# EasyEDA Pro project 4轴3.0控制板PCB源文件LY-4X3.0-V3.4.eprj, board 4轴3.0
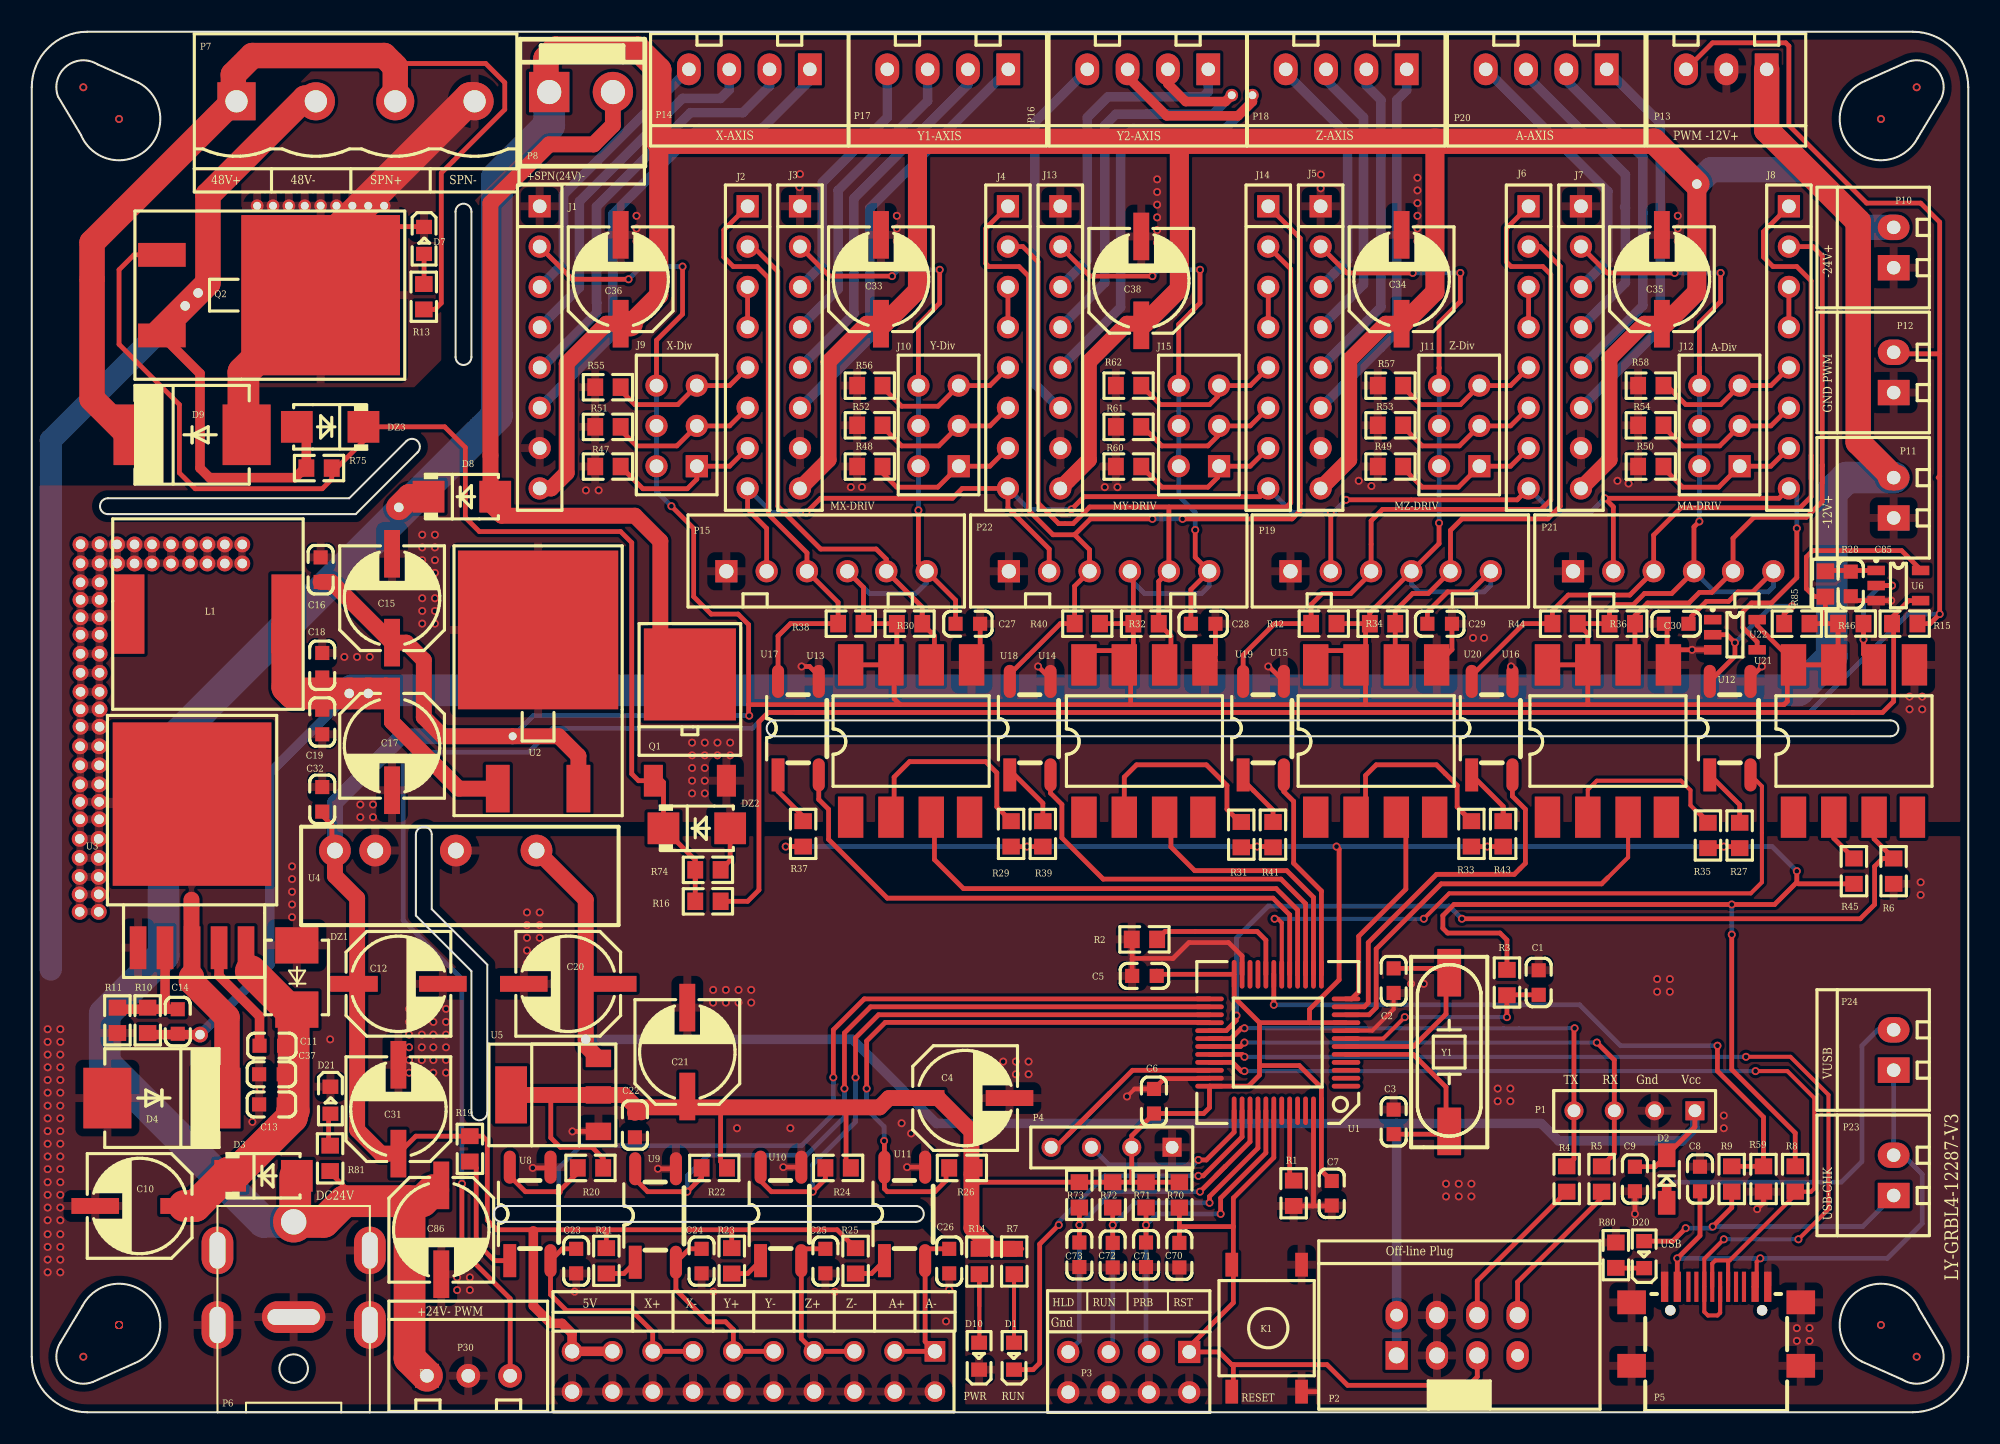
[diagram p1: board, top side]
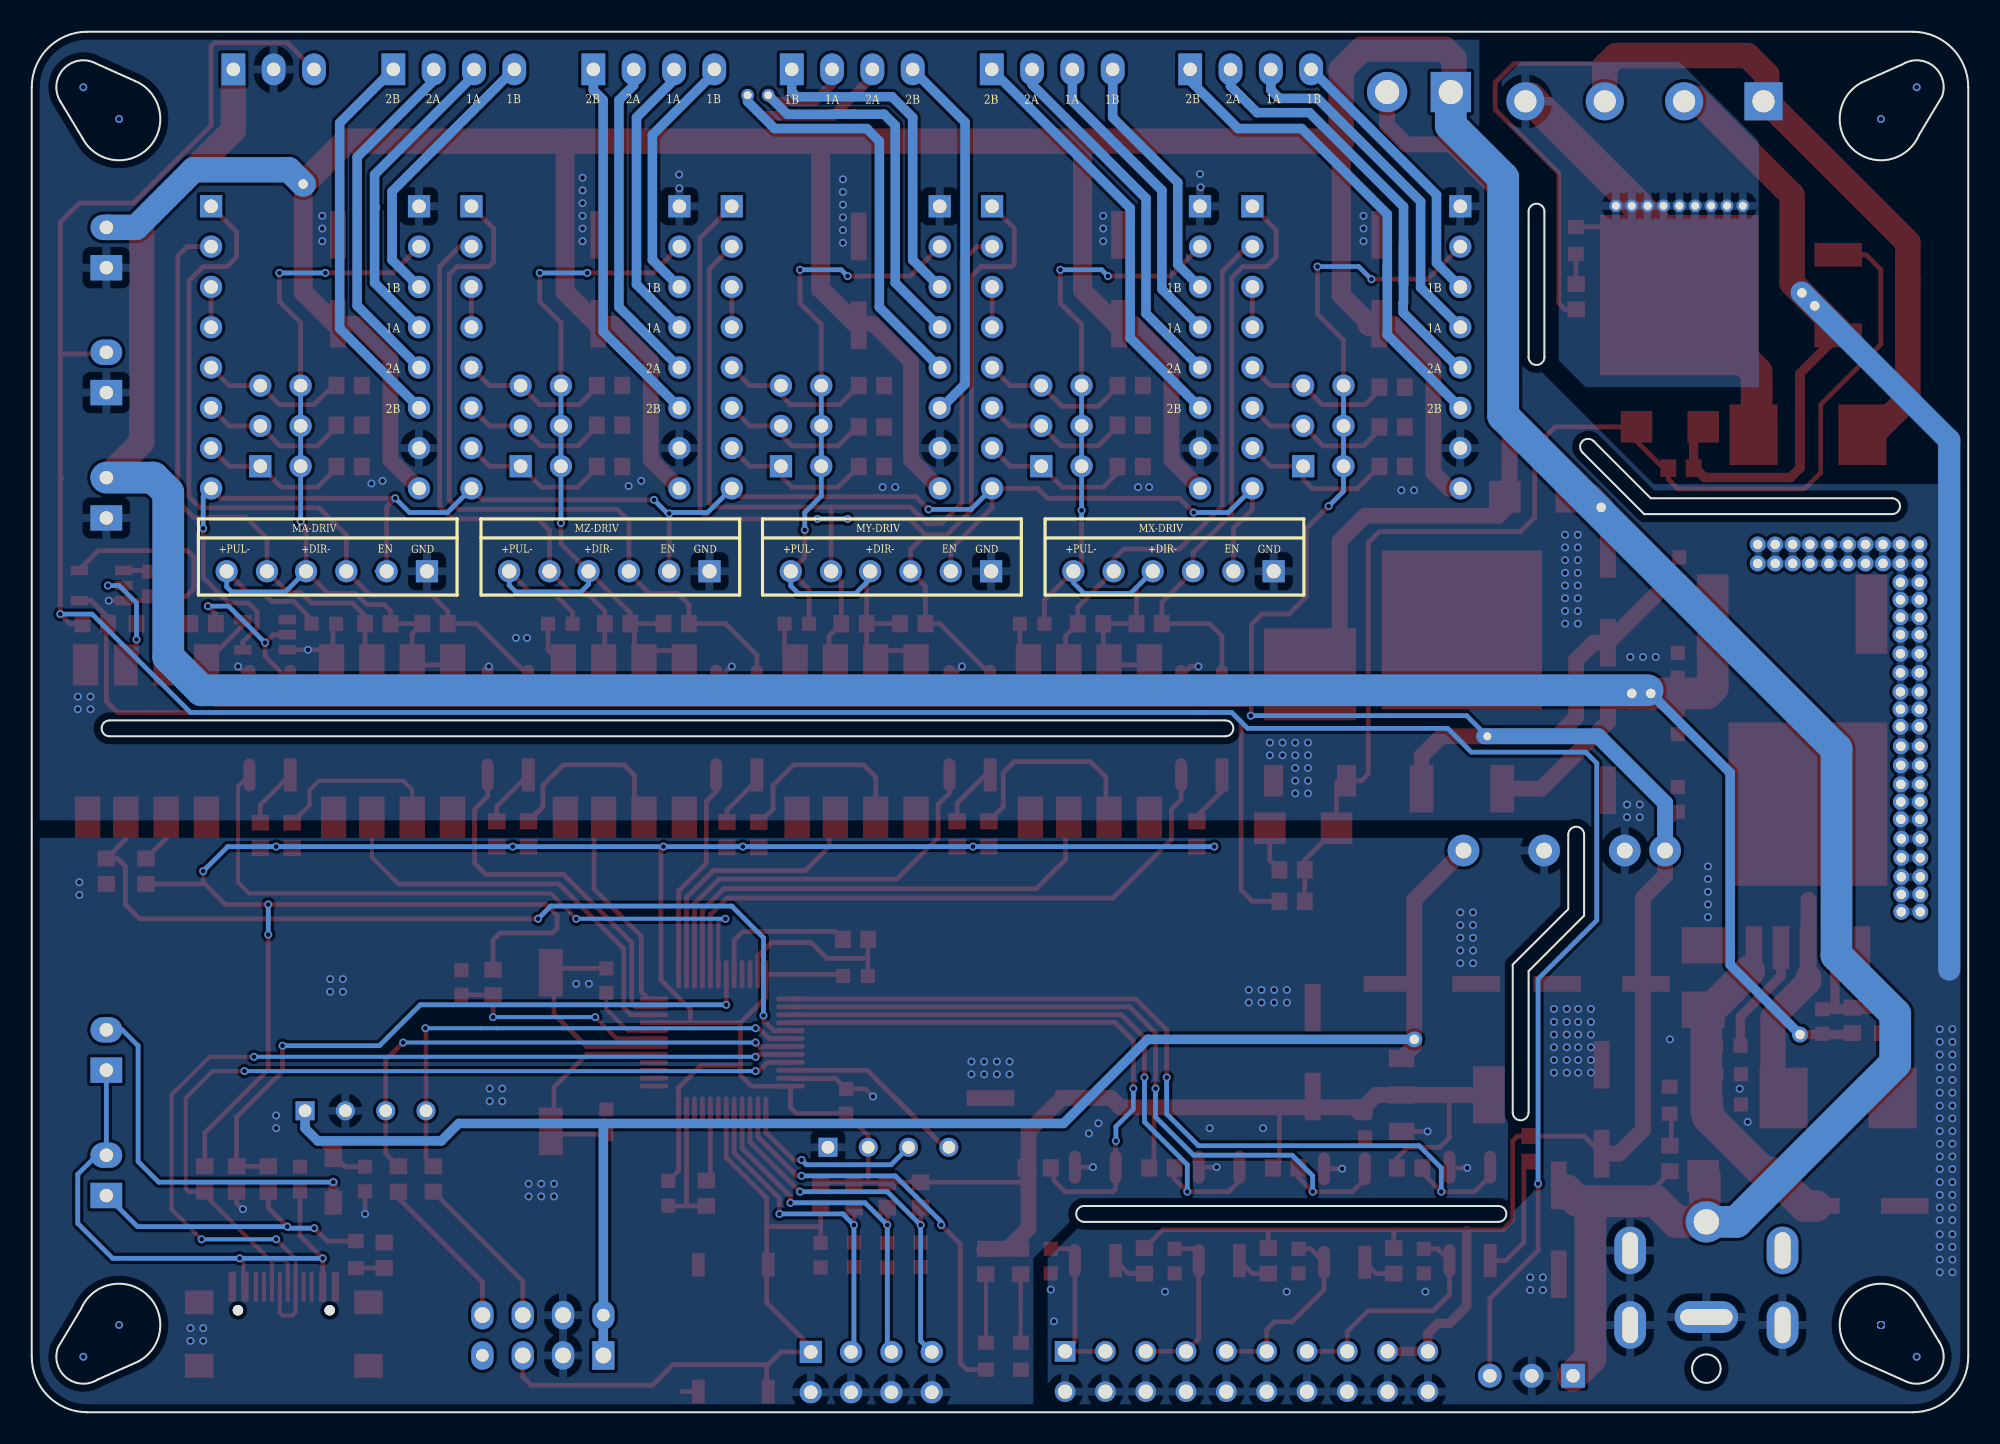
[diagram p2: board, bottom side, seen from below]

Outline 122 x 87 mm; copper layers: Top Layer, Bottom Layer. Coordinates in mm from the lower left corner of the outline.
Outline path: 0,83.5 0,3.5 arc(1.03,1.03) 3.5,0 118.5,0 arc(120.97,1.03) 122,3.5 122,83.5 arc(120.97,85.97) 118.5,87 3.5,87 arc(1.03,85.97) 0,83.5 ; 1.65,82.92 3.1,80.5 arc(7.26,79.58) 6.7,83.81 4.15,84.94 arc(2.18,84.82) 1.65,82.92 ; 3.19,6.7 1.81,4.4 arc(1.93,2.43) 3.83,1.9 6.5,3.1 arc(7.42,7.26) 3.19,6.7 ; 4.8,56.6 arc(4.3,57.1) 4.8,57.6 20,57.6 23.6,61.2 arc(24.31,61.2) 24.31,60.49 20.41,56.6 4.8,56.6 ; 24.2,36.4 24.2,31.3 27.7,27.8 27.7,18.9 arc(28.2,18.4) 28.7,18.9 28.7,28.21 25.2,31.71 25.2,36.4 arc(24.7,36.9) 24.2,36.4 ; 26.7,75.66 26.7,66.5 arc(27.2,66) 27.7,66.5 27.7,75.66 arc(27.2,76.16) 26.7,75.66 ; 29.6,12 arc(29.1,12.5) 29.6,13 55.7,13 arc(56.2,12.5) 55.7,12 29.6,12 ; 46.8,42.6 arc(46.3,43.1) 46.8,43.6 117.1,43.6 arc(117.6,43.1) 117.1,42.6 46.8,42.6 ; 115.3,3.19 117.85,2.06 arc(119.82,2.18) 120.35,4.09 118.9,6.5 arc(114.74,7.42) 115.3,3.19 ; 118.16,85.1 115.5,83.9 arc(114.58,79.74) 118.81,80.3 120.19,82.6 arc(120.07,84.57) 118.16,85.1
Stack: Top Layer 0.0356mm / Dielectric1 0.32mm FR-4 er 4.8 / Bottom Layer 0.0356mm

## Design rules (mm)
net C86: Top Side Components
net P30: Top Side Components
net R85: Top Side Components
net C85: Top Side Components
net R75: Top Side Components
net R74: Top Side Components
net DZ3: Top Side Components
net DZ2: Top Side Components
net U22: Top Side Components
net C37: Top Side Components
net C1: Top Side Components
net C2: Top Side Components
net C3: Top Side Components
net C4: Top Side Components
net C5: Top Side Components
net C6: Top Side Components
net C7: Top Side Components
net C8: Top Side Components
net C9: Top Side Components
net C10: Top Side Components
net C11: Top Side Components
net C12: Top Side Components
net C13: Top Side Components
net C14: Top Side Components
net C15: Top Side Components
net C16: Top Side Components
net C17: Top Side Components
net C18: Top Side Components
net C19: Top Side Components
net C20: Top Side Components
net C21: Top Side Components
net C22: Top Side Components
net C23: Top Side Components
net C24: Top Side Components
net C25: Top Side Components
net C26: Top Side Components
net C27: Top Side Components
net C28: Top Side Components
net C29: Top Side Components
net C30: Top Side Components
net C31: Top Side Components
net C32: Top Side Components
net C33: Top Side Components
net C34: Top Side Components
net C35: Top Side Components
net C36: Top Side Components
net D1: Top Side Components
net D2: Top Side Components
net D3: Top Side Components
net D4: Top Side Components
net D7: Top Side Components
net D8: Top Side Components
net D9: Top Side Components
net D10: Top Side Components
net DZ1: Top Side Components
net J1: Top Side Components
net J2: Top Side Components
net J3: Top Side Components
net J4: Top Side Components
net J5: Top Side Components
net J6: Top Side Components
net J7: Top Side Components
net J8: Top Side Components
net J9: Top Side Components
net J10: Top Side Components
net J11: Top Side Components
net J12: Top Side Components
net K1: Top Side Components
net L1: Top Side Components
net P1: Top Side Components
net P2: Top Side Components
net P3: Top Side Components
net P4: Top Side Components
net P6: Top Side Components
net P7: Top Side Components
net P8: Top Side Components
net P9: Top Side Components
net P10: Top Side Components
net P11: Top Side Components
net P12: Top Side Components
net P13: Top Side Components
net P14: Top Side Components
net P15: Top Side Components
net P17: Top Side Components
net P18: Top Side Components
net P19: Top Side Components
net P20: Top Side Components
net P21: Top Side Components
net P22: Top Side Components
net Q1: Top Side Components
net Q2: Top Side Components
net R1: Top Side Components
net R2: Top Side Components
net R3: Top Side Components
net R4: Top Side Components
net R5: Top Side Components
net R6: Top Side Components
net R7: Top Side Components
net R8: Top Side Components
net R10: Top Side Components
net R11: Top Side Components
net R13: Top Side Components
net R14: Top Side Components
net R15: Top Side Components
net R16: Top Side Components
net R19: Top Side Components
net R20: Top Side Components
net R21: Top Side Components
net R22: Top Side Components
net R23: Top Side Components
net R24: Top Side Components
net R25: Top Side Components
net R26: Top Side Components
net R27: Top Side Components
net R28: Top Side Components
net R29: Top Side Components
net R30: Top Side Components
net R31: Top Side Components
net R32: Top Side Components
net R33: Top Side Components
net R34: Top Side Components
net R35: Top Side Components
net R36: Top Side Components
net R37: Top Side Components
net R38: Top Side Components
net R39: Top Side Components
net R40: Top Side Components
net R41: Top Side Components
net R42: Top Side Components
net R43: Top Side Components
net R44: Top Side Components
net R45: Top Side Components
net R46: Top Side Components
net R47: Top Side Components
net R48: Top Side Components
net R49: Top Side Components
net R50: Top Side Components
net R51: Top Side Components
net R52: Top Side Components
net R53: Top Side Components
net R54: Top Side Components
net R55: Top Side Components
net R56: Top Side Components
net R57: Top Side Components
net R58: Top Side Components
net U1: Top Side Components
net U2: Top Side Components
net U3: Top Side Components
net U4: Top Side Components
net U5: Top Side Components
net U6: Top Side Components
net U8: Top Side Components
net U9: Top Side Components
net U10: Top Side Components
net U11: Top Side Components
net U12: Top Side Components
net U13: Top Side Components
net U14: Top Side Components
net U15: Top Side Components
net U16: Top Side Components
net U17: Top Side Components
net U18: Top Side Components
net U19: Top Side Components
net U20: Top Side Components
net U21: Top Side Components
net Y1: Top Side Components
net R9: Top Side Components
net R59: Top Side Components
net P5: Top Side Components
net D20: Top Side Components
net R80: Top Side Components
net D21: Top Side Components
net R81: Top Side Components
net C38: Top Side Components
net J13: Top Side Components
net J14: Top Side Components
net J15: Top Side Components
net P16: Top Side Components
net R60: Top Side Components
net R61: Top Side Components
net R62: Top Side Components
net P23: Top Side Components
net P24: Top Side Components
net C70: Top Side Components
net C71: Top Side Components
net C72: Top Side Components
net C73: Top Side Components
net R70: Top Side Components
net R71: Top Side Components
net R72: Top Side Components
net R73: Top Side Components
net D6: 电源
net R12: 电源
spacing Clearance (default): track to track 0.178, other pairs 0.178 to 0.178
track width Width (default): min 0.1, default 0.254, max 5
differential pair DiffPairsRouting (default): width min 0.381, default 0.381, max 0.381; gap min 0.254, default 0.254
via RoutingVias (default): diameter min 0.3, default 0.8, max 1.27; hole min 0.3, default 0.6, max 2

## Placement (name value [footprint] x y rotation side)
C1  104  [0603C]  94.94 27.08 270 top
C2  100pF  [0603C]  85.8 27.2 270 top
C3  100pF  [0603C]  85.8 18.3 90 top
C4  220uF/16V  [电解电容贴片6x6]  58.8 19.8 0 top
C5  104  [0603C]  70.1 27.5 0 top
C6  104  [0603C]  70.7 19.6 270 top
C7  104  [0603C]  81.9 13.8 90 top
C8  104  [0603C]  105.1 14.7 270 top
C9  104  [0603C]  101 14.7 90 top
C10  47uF/50V  [电解电容贴片6x6]  6.8 13 180 top
C11  105  [0603C]  15.13 23.1 0 top
C12  100uF/35V  [电解电容贴片6x6]  23.1 27 0 top
C13  105  [0603C]  15.1 19.4 0 top
C14  33nF  [0603C]  9.2 24.63 270 top
C15  100uF/35V  [电解电容贴片6x6]  22.7 51.3 90 top
C16  105  [0603C]  18.2 53.1 270 top
C17  100uF/35V  [电解电容贴片6x6]  22.7 42 270 top
C18  105  [0603C]  18.3 47.07 270 top
C19  104  [0603C]  18.3 43.5 90 top
C20  100uF/35V  [电解电容贴片6x6]  33.8 27 180 top
C21  100uF/35V  [电解电容贴片6x6]  41.3 22.7 90 top
C22  104  [0603C]  38 18.1 90 top
C23  104  [0603C]  34.3 9.53 90 top
C24  104  [0603C]  42.2 9.53 90 top
C25  104  [0603C]  50 9.53 90 top
C26  104  [0603C]  57.8 9.53 90 top
C27  104  [0603C]  58.97 49.69 180 top
C28  104  [0603C]  73.8 49.69 180 top
C29  104  [0603C]  88.7 49.69 180 top
C30  104  [0603C]  103.6 49.69 0 top
C31  220uF/16V  [电解电容贴片6x6]  23.1 19.1 90 top
C32  104  [0603C]  18.3 38.63 270 top
C33  47uF/50V  [电解电容贴片6x6]  53.5 71.4 90 top
C34  47uF/50V  [电解电容贴片6x6]  86.3 71.4 90 top
C35  47uF/50V  [电解电容贴片6x6]  102.7 71.4 90 top
C36  47uF/50V  [电解电容贴片6x6]  37.1 71.4 90 top
C37  104  [0603C]  15.1 21.3 0 top
C38  47uF/50V  [电解电容贴片6x6]  69.9 71.3 90 top
C70  18pF  [0603C]  72.3 9.9 90 top
C71  18pF  [0603C]  70.2 9.93 90 top
C72  18pF  [0603C]  68.1 9.9 90 top
C73  18pF  [0603C]  66 9.93 90 top
C85  18pF  [0603C]  114.6 52.2 90 top
C86  47uF/50V  [电解电容贴片6x6]  25.8 11.5 270 top
D1  绿光  [0603LED]  61.9 3.5 270 top
D2  S4  [SOD-123]  103 14.7 90 top
D3  SS56  [SMA]  14.6 14.9 0 top
D4  SS56  [SMC]  8.2 19.8 180 top
D7  绿光  [0603LED]  24.7 73.88 90 top
D8  SS56  [SMA]  27.1 57.7 0 top
D9  RS5M  [SMC]  10.1 61.6 0 top
D10  红光  [0603LED]  59.7 3.5 270 top
D20  红光  [0603LED]  101.6 9.9 270 top
D21  红光  [0603LED]  18.8 19.7 90 top
DZ1  SMBJ36A  [SMB]  16.7 27.4 90 top
DZ2  SMAZ10V  [SMA]  41.9 36.8 0 top
DZ3  SMAZ10V  [SMA]  18.8 62.1 180 top
J1  8P  [HDR1X8]  32 65.84 270 top
J2  8P  [HDR1X8]  45.1 65.84 270 top
J3  8P  [HDR1X8]  48.4 65.84 270 top
J4  8P  [HDR1X8]  61.5 65.84 270 top
J5  8P  [HDR1X8]  81.2 65.84 270 top
J6  8P  [HDR1X8]  94.3 65.84 270 top
J7  8P  [HDR1X8]  97.6 65.84 270 top
J8  8P  [HDR1X8]  110.7 65.84 270 top
J9  DIV-X  [HDR2X3]  41.9 59.62 90 top
J10  DIV-Y  [HDR2X3]  58.4 59.62 90 top
J11  DIV-Z  [HDR2X3]  91.2 59.62 90 top
J12  DIV-A  [HDR2X3]  107.6 59.62 90 top
J13  8P  [HDR1X8]  64.8 65.84 270 top
J14  8P  [HDR1X8]  77.9 65.84 270 top
J15  DIV-Y2  [HDR2X3]  74.8 59.62 90 top
K1  开关  [按键6x6贴片]  77.8 5.3 0 top
L1  47uH/5A  [电感贴片12x12]  11.1 50.3 0 top
NOREF  -  [Pad_ie79]  3.07 45.4 0 top
NOREF#2  -  [Pad_ie95]  20.2 76.03 180 top
NOREF#3  -  [Pad_ie36]  5.37 53.49 270 top
NOREF#4  -  [Pad_ie45]  3.02 33.74 0 top
NOREF#5  -  [Pad_ie89]  30.3 42.6 180 top
NOREF#6  -  [Pad_ie51]  4.22 36.14 0 top
NOREF#7  -  [Pad_ie41]  104.9 77.4 90 top
NOREF#8  -  [Pad_ie59]  4.25 38.47 0 top
NOREF#9  -  [Pad_ie99]  76.9 83 0 top
NOREF#10  -  [Pad_ie38]  7.57 53.49 270 top
NOREF#11  -  [Pad_ie57]  4.25 40.77 0 top
NOREF#12  -  [Pad_ie55]  3.05 39.57 0 top
NOREF#13  -  [Pad_ie71]  4.27 50.1 0 top
NOREF#14  -  [Pad_ie25]  13.26 54.69 270 top
NOREF#15  -  [Pad_ie68]  4.27 53.5 0 top
NOREF#16  -  [Pad_ie29]  12.16 53.49 270 top
NOREF#17  -  [Pad_ie39]  8.77 53.49 270 top
NOREF#18  -  [Pad_ie35]  5.37 54.69 270 top
NOREF#19  -  [Pad_ie64]  9.67 69.72 180 top
NOREF#20  -  [Pad_ie28]  11.06 53.49 270 top
NOREF#21  -  [Pad_ie98]  75.6 83 0 top
NOREF#22  -  [Pad_ie58]  4.25 39.57 0 top
NOREF#23  -  [Pad_ie37]  6.47 53.49 270 top
NOREF#24  -  [Pad_ie83]  3.07 49 0 top
NOREF#25  -  [Pad_ie75]  4.27 44.3 0 top
NOREF#26  -  [Pad_ie80]  3.07 44.3 0 top
NOREF#27  -  [Pad_ie91]  16.2 76.03 180 top
NOREF#28  -  [Pad_ie30]  13.26 53.49 270 top
NOREF#29  -  [Pad_ie69]  4.27 52.3 0 top
NOREF#30  -  [Pad_ie65]  34.9 23.5 0 top
NOREF#31  -  [Pad_ie34]  6.47 54.69 270 top
NOREF#32  -  [Pad_ie44]  3.02 32.64 0 top
NOREF#33  -  [Pad_ie97]  22.2 76.03 180 top
NOREF#34  -  [Pad_ie63]  10.48 70.54 180 top
NOREF#35  -  [Pad_ie54]  3.05 38.47 0 top
NOREF#36  -  [Pad_ie90]  15.2 76.03 180 top
NOREF#37  -  [Pad_ie31]  9.97 54.69 270 top
NOREF#38  -  [Pad_ie87]  3.07 53.5 0 top
NOREF#39  -  [Pad_ie85]  3.07 51.2 0 top
NOREF#40  -  [Pad_ie77]  4.27 46.6 0 top
NOREF#41  -  [Pad_ie67]  4.27 54.7 0 top
NOREF#42  -  [Pad_ie102]  23.12 57.02 0 top
NOREF#43  -  [Pad_ie76]  4.27 45.4 0 top
NOREF#44  -  [Pad_ie73]  4.27 47.8 0 top
NOREF#45  -  [Pad_ie50]  4.22 31.54 0 top
NOREF#46  -  [Pad_ie40]  9.97 53.49 270 top
NOREF#47  -  [Pad_ie88]  3.07 54.7 0 top
NOREF#48  -  [Pad_ie47]  4.22 34.94 0 top
NOREF#49  -  [Pad_ie101]  21.2 45.3 0 top
NOREF#50  -  [Pad_ie93]  18.2 76.03 180 top
NOREF#51  -  [Pad_ie66]  20 45.3 0 top
NOREF#52  -  [Pad_ie46]  3.02 34.94 0 top
NOREF#53  -  [Pad_ie82]  3.07 47.8 0 top
NOREF#54  -  [Pad_ie27]  11.06 54.69 270 top
NOREF#55  -  [Pad_ie96]  21.2 76.03 180 top
NOREF#56  -  [Pad_ie94]  19.2 76.03 180 top
NOREF#57  -  [Pad_ie62]  10.6 23.8 90 top
NOREF#58  -  [Pad_ie92]  17.2 76.03 180 top
NOREF#59  -  [Pad_ie43]  3.02 31.54 0 top
NOREF#60  -  [Pad_ie49]  4.22 32.64 0 top
NOREF#61  -  [Pad_ie56]  3.05 40.77 0 top
NOREF#62  -  [Pad_ie60]  4.25 37.37 0 top
NOREF#63  -  [Pad_ie78]  3.07 46.6 0 top
NOREF#64  -  [Pad_ie26]  12.16 54.69 270 top
NOREF#65  -  [Pad_ie52]  3.05 41.97 0 top
NOREF#66  -  [Pad_ie100]  14.2 76.03 180 top
NOREF#67  -  [Pad_ie81]  3.07 43.2 0 top
NOREF#68  -  [Pad_ie42]  3.02 36.14 0 top
NOREF#69  -  [Pad_ie84]  3.07 50.1 0 top
NOREF#70  -  [Pad_ie48]  4.22 33.74 0 top
NOREF#71  -  [Pad_ie70]  4.27 51.2 0 top
NOREF#72  -  [Pad_ie32]  8.77 54.69 270 top
NOREF#73  -  [Pad_ie61]  4.25 41.97 0 top
NOREF#74  -  [Pad_ie72]  4.27 49 0 top
NOREF#75  -  [Pad_ie53]  3.05 37.37 0 top
NOREF#76  -  [Pad_ie74]  4.27 43.2 0 top
NOREF#77  -  [Pad_ie33]  7.57 54.69 270 top
NOREF#78  -  [Pad_ie86]  3.07 52.3 0 top
P1  4P  [SIP4]  104.78 19 180 top
P2  8P  [IDC8]  89.8 4.6 0 top
P3  Header 4X2H  [HDR2X4H]  72.92 3.8 180 top
P4  4P  [SIP4]  71.84 16.7 180 top
P5  USB座TYPE-C-16P  [USB-TYPE-C-16P-全贴片]  106.12 5.22 0 top
P6  -  [DC007B]  16.5 0 270 top
P7  DF2EDGK-4P  [直插座4P-DF2EDGK]  20.4 82.62 0 top
P8  2P  [VH3.96-2P直插座]  34.75 84.04 180 top
P9  Header 10X2H  [HDR2X10]  56.9 3.84 180 top
P10  2P红色  [HDR1X2_CON]  117.3 73.4 90 top
P11  2P红色  [HDR1X2_CON]  117.3 57.63 90 top
P12  2P  [HDR1X2_CON]  117.3 65.53 90 top
P13  3P  [HDR1X3_CON#2]  106.76 84.63 180 top
P14  4P  [HDR1X4_CON]  49.02 84.63 180 top
P15  6P  [HDR1X6_CON]  43.76 53 0 top
P16  4P  [HDR1X4_CON]  74.12 84.63 180 top
P17  4P  [HDR1X4_CON]  61.52 84.63 180 top
P18  4P  [HDR1X4_CON]  86.62 84.63 180 top
P19  6P  [HDR1X6_CON]  79.3 53 0 top
P20  4P  [HDR1X4_CON]  99.22 84.63 180 top
P21  6P  [HDR1X6_CON]  97.1 53 0 top
P22  6P  [HDR1X6_CON]  61.56 53 0 top
P23  2P  [HDR1X2_CON]  117.3 14.93 90 top
P24  2P  [HDR1X2_CON]  117.3 22.83 90 top
P30  3P  [HDR1X3_CON]  27.5 2.3 0 top
Q1  50N06  [TO-252]  41.46 42.4 0 top
Q2  F540NS  [TO-263-2]  8.2 70.4 180 top
R1  10K  [0603R]  79.5 13.8 90 top
R2  10K  [0603R]  70.1 29.8 0 top
R3  10K  [0603R]  92.94 27.08 270 top
R4  100  [0603R]  96.7 14.7 270 top
R5  100  [0603R]  98.9 14.7 270 top
R6  2K  [0603R]  117.3 34.1 90 top
R7  1K  [0603R]  61.9 9.5 90 top
R8  10K  [0603R]  111.1 14.7 270 top
R9  1K  [0603R]  107.1 14.7 90 top
R10  16K  [0603R]  7.3 24.7 270 top
R11  1.8K  [0603R]  5.4 24.7 90 top
R13  10K  [0603R]  24.7 70.3 90 top
R14  1K  [0603R]  59.7 9.5 270 top
R15  100  [0603R]  118 49.7 180 top
R16  680  [0603R]  42.6 32.2 180 top
R19  680  [0603R]  27.6 16.6 270 top
R20  10K  [0603R]  35.2 15.4 180 top
R21  680  [0603R]  36.2 9.54 270 top
R22  10K  [0603R]  43 15.4 180 top
R23  680  [0603R]  44.1 9.54 270 top
R24  10K  [0603R]  50.8 15.4 180 top
R25  680  [0603R]  51.9 9.54 270 top
R26  10K  [0603R]  58.6 15.4 180 top
R27  470  [0603R]  107.6 36.35 90 top
R28  10K  [0603R]  111.2 49.7 180 top
R29  470  [0603R]  61.7 36.45 90 top
R30  470  [0603R]  55.3 49.69 0 top
R31  470  [0603R]  76.2 36.4 90 top
R32  470  [0603R]  70.2 49.69 0 top
R33  470  [0603R]  90.7 36.45 90 top
R34  470  [0603R]  85.1 49.69 0 top
R35  470  [0603R]  105.6 36.35 90 top
R36  470  [0603R]  100.2 49.69 0 top
R37  470  [0603R]  48.6 36.45 90 top
R38  10K  [0603R]  51.6 49.7 180 top
R39  470  [0603R]  63.7 36.45 90 top
R40  10K  [0603R]  66.5 49.7 180 top
R41  470  [0603R]  78.2 36.4 90 top
R42  10K  [0603R]  81.4 49.7 180 top
R43  470  [0603R]  92.7 36.45 90 top
R44  10K  [0603R]  96.6 49.7 180 top
R45  470  [0603R]  114.8 34.1 90 top
R46  470  [0603R]  114.6 49.7 0 top
R47  10K  [0603R]  36.3 59.6 180 top
R48  10K  [0603R]  52.8 59.6 180 top
R49  10K  [0603R]  85.6 59.6 180 top
R50  10K  [0603R]  102 59.6 180 top
R51  10K  [0603R]  36.3 62.1 180 top
R52  10K  [0603R]  52.8 62.2 180 top
R53  10K  [0603R]  85.6 62.2 180 top
R54  10K  [0603R]  102 62.2 180 top
R55  10K  [0603R]  36.3 64.6 180 top
R56  10K  [0603R]  52.8 64.7 180 top
R57  10K  [0603R]  85.6 64.7 180 top
R58  10K  [0603R]  102 64.7 180 top
R59  1.8K  [0603R]  109.1 14.7 270 top
R60  10K  [0603R]  69.1 59.6 180 top
R61  10K  [0603R]  69.1 62.1 180 top
R62  10K  [0603R]  69.1 64.7 180 top
R70  10K  [0603R]  72.3 13.7 90 top
R71  10K  [0603R]  70.2 13.7 90 top
R72  10K  [0603R]  68.1 13.7 90 top
R73  10K  [0603R]  66 13.7 90 top
R74  10K  [0603R]  42.6 34.18 0 top
R75  10K  [0603R]  18.1 59.5 0 top
R80  1K  [0603R]  99.8 9.9 90 top
R81  10K  [0603R]  18.8 16 90 top
R85  10K  [0603R]  113 52.2 90 top
U1  STM32F103C8T6/CBT6  [LQFP48]  78.5 23.3 180 top
U2  CJ7805  [TO-263-2]  31.9 39.3 270 top
U3  XL4015  [TO-263]  10.1 33.8 0 top
U4  B0505LS-1WR2  [B0505LS-1W]  25.45 35.4 0 top
U5  1117-3.3  [SOT-223]  33 20 90 top
U6  74LVC1G126/74LVC1G08  [SOT-23-5]  117.6 52.1 0 top
U8  LTV-357T-B  [SOP4]  31.4 12.5 90 top
U9  LTV-357T-B  [SOP4]  39.3 12.4 90 top
U10  LTV-357T-B  [SOP4]  47.2 12.5 90 top
U11  LTV-357T-B  [SOP4]  55 12.5 90 top
U12  LTV-357T-B  [SOP4]  107 43.11 90 top
U13  6N137  [SMD8]  55.4 42.3 0 top
U14  6N137  [SMD8]  70.1 42.3 0 top
U15  6N137  [SMD8]  84.7 42.3 0 top
U16  6N137  [SMD8]  99.3 42.3 0 top
U17  LTV-357T-B  [SOP4]  48.3 43.11 90 top
U18  LTV-357T-B  [SOP4]  62.9 43.11 90 top
U19  LTV-357T-B  [SOP4]  77.6 43.11 90 top
U20  LTV-357T-B  [SOP4]  92 43.11 90 top
U21  6N137  [SMD8#2]  114.8 42.3 0 top
U22  74LVC1G17  [SOT-23-5]  107.3 49 0 top
Y1  8M  [晶振贴片]  89.3 22.7 90 top

## Footprints (pads in the part's own frame, mm; a bottom-side part is the same pattern mirrored in y, then rotated)
0603C
  rect 0.889x0.889 smd: 1(-0.774,0) 2(0.774,0)
0603LED
  rect 0.9x1 smd: 1(-0.884,-0.017) 2(0.816,-0.017)
0603R
  rect 1x1.1 smd: 1(-0.8,0) 2(0.8,0)
B0505LS-1W
  round 2 hole 1: 1(-6.35,0) 2(-3.81,0) 4(1.27,0) 6(6.35,0)
DC007B
  round 2.6 hole 1.6: 1(-12,0)
  oval 2x4 hole 1x3.3: 2(-6,0)
  oval 3x2 hole 2.3x1: 3(-5.5,4.8) 4(-10.2,4.8) 5(-5.5,-4.8) 6(-10.2,-4.8)
HDR1X2_CON
  rect 1.6x2 hole 0.85: 1(-1.27,0)
  oval 1.6x2 hole 0.85: 2(1.27,0)
HDR1X3_CON
  rect 1.5x1.5 hole 0.86: 1(-2.6,0)
  round 1.5 hole 0.86: 2(0,0) 3(2.64,0)
HDR1X3_CON#2
  rect 1.5x2 hole 0.85: 1(-2.54,0)
  oval 1.5x2 hole 0.85: 2(0,0) 3(2.54,0)
HDR1X4_CON
  rect 1.5x2 hole 0.85: 1(0,0)
  oval 1.5x2 hole 0.85: 2(2.54,0) 3(5.08,0) 4(7.62,0)
HDR1X6_CON
  rect 1.4x1.4 hole 0.9: 1(0,0)
  round 1.4 hole 0.9: 2(2.54,0) 3(5.08,0) 4(7.62,0) 5(10.08,0) 6(12.62,0)
HDR1X8
  rect 1.4x1.4 hole 0.86: 1(-10.16,0)
  round 1.4 hole 0.86: 2(-7.62,0) 3(-5.08,0) 4(-2.54,0) 5(0,0) 6(2.54,0) 7(5.08,0) 8(7.62,0)
HDR2X3
  rect 1.4x1.4 hole 0.86: 1(0,0)
  round 1.4 hole 0.86: 2(2.54,0) 3(5.08,0) 4(5.08,2.54) 5(2.54,2.54) 6(0,2.54)
HDR2X4H
  rect 1.4x1.4 hole 0.86: 1(0,0)
  round 1.4 hole 0.86: 2(0,2.54) 3(2.54,0) 4(2.54,2.54) 5(5.08,0) 6(5.08,2.54) 7(7.62,0) 8(7.62,2.54)
HDR2X10
  rect 1.3x1.3 hole 0.9: 1(0,0)
  round 1.3 hole 0.9: 2(0,2.54) 3(2.54,0) 4(2.54,2.54) 5(5.08,0) 6(5.08,2.54) 7(7.62,0) 8(7.62,2.54) 9(10.16,0) 10(10.16,2.54) 11(12.7,0) 12(12.7,2.54) 13(15.24,0) 14(15.24,2.54) 15(17.78,0) 16(17.78,2.54) 17(20.32,0) 18(20.32,2.54) 19(22.86,0) 20(22.86,2.54)
IDC8
  rect 1.4x1.8 hole 1: 1(-3.812,-1.019)
  oval 1.4x1.8 hole 0.8: 2(-3.812,1.521) 7(3.808,-1.019)
  oval 1.4x1.8 hole 1: 3(-1.272,-1.019) 4(-1.272,1.521) 5(1.268,-1.019) 6(1.268,1.521) 8(3.808,1.521)
LQFP48
  oval 1.8x0.3 smd: 1(-4.3,2.75) 2(-4.3,2.25) 3(-4.3,1.75) 4(-4.3,1.25) 5(-4.3,0.75) 6(-4.3,0.25) 7(-4.3,-0.25) 8(-4.3,-0.75) 9(-4.3,-1.25) 10(-4.3,-1.75) 11(-4.3,-2.25) 12(-4.3,-2.75) 25(4.3,-2.75) 26(4.3,-2.25) 27(4.3,-1.75) 28(4.3,-1.25) 29(4.3,-0.75) 30(4.3,-0.25) 31(4.3,0.25) 32(4.3,0.75) 33(4.3,1.25) 34(4.3,1.75) 35(4.3,2.25) 36(4.3,2.75)
  oval 0.3x1.8 smd: 13(-2.75,-4.3) 14(-2.25,-4.3) 15(-1.75,-4.3) 16(-1.25,-4.3) 17(-0.75,-4.3) 18(-0.25,-4.3) 19(0.25,-4.3) 20(0.75,-4.3) 21(1.25,-4.3) 22(1.75,-4.3) 23(2.25,-4.3) 24(2.75,-4.3) 37(2.75,4.3) 38(2.25,4.3) 39(1.75,4.3) 40(1.25,4.3) 41(0.75,4.3) 42(0.25,4.3) 43(-0.25,4.3) 44(-0.75,4.3) 45(-1.25,4.3) 46(-1.75,4.3) 47(-2.25,4.3) 48(-2.75,4.3)
Pad_ie25
  round 1 hole 0.6: 2(0,0)
Pad_ie26
  round 1 hole 0.6: 3(0,0)
Pad_ie27
  round 1 hole 0.6: 4(0,0)
Pad_ie28
  round 1 hole 0.6: 4(0,0)
Pad_ie29
  round 1 hole 0.6: 3(0,0)
Pad_ie30
  round 1 hole 0.6: 2(0,0)
Pad_ie31
  round 1 hole 0.6: 0(0,0)
Pad_ie32
  round 1 hole 0.6: 1(0,0)
Pad_ie33
  round 1 hole 0.6: 2(0,0)
Pad_ie34
  round 1 hole 0.6: 3(0,0)
Pad_ie35
  round 1 hole 0.6: 4(0,0)
Pad_ie36
  round 1 hole 0.6: 4(0,0)
Pad_ie37
  round 1 hole 0.6: 3(0,0)
Pad_ie38
  round 1 hole 0.6: 2(0,0)
Pad_ie39
  round 1 hole 0.6: 1(0,0)
Pad_ie40
  round 1 hole 0.6: 0(0,0)
Pad_ie41
  round 1 hole 0.6: 1(0,0)
Pad_ie42
  round 1 hole 0.6: 6(0,0)
Pad_ie43
  round 1 hole 0.6: 4(0,0)
Pad_ie44
  round 1 hole 0.6: 3(0,0)
Pad_ie45
  round 1 hole 0.6: 2(0,0)
Pad_ie46
  round 1 hole 0.6: 1(0,0)
Pad_ie47
  round 1 hole 0.6: 1(0,0)
Pad_ie48
  round 1 hole 0.6: 2(0,0)
Pad_ie49
  round 1 hole 0.6: 3(0,0)
Pad_ie50
  round 1 hole 0.6: 4(0,0)
Pad_ie51
  round 1 hole 0.6: 6(0,0)
Pad_ie52
  round 1 hole 0.6: 6(0,0)
Pad_ie53
  round 1 hole 0.6: 4(0,0)
Pad_ie54
  round 1 hole 0.6: 3(0,0)
Pad_ie55
  round 1 hole 0.6: 2(0,0)
Pad_ie56
  round 1 hole 0.6: 1(0,0)
Pad_ie57
  round 1 hole 0.6: 1(0,0)
Pad_ie58
  round 1 hole 0.6: 2(0,0)
Pad_ie59
  round 1 hole 0.6: 3(0,0)
Pad_ie60
  round 1 hole 0.6: 4(0,0)
Pad_ie61
  round 1 hole 0.6: 6(0,0)
Pad_ie62
  round 1 hole 0.6: 0(0,0)
Pad_ie63
  round 1 hole 0.6: 1(0,0)
Pad_ie64
  round 1 hole 0.6: 0(0,0)
Pad_ie65
  round 1 hole 0.6: 12(0,0)
Pad_ie66
  round 1 hole 0.6: 8(0,0)
Pad_ie67
  round 1 hole 0.6: 0(0,0)
Pad_ie68
  round 1 hole 0.6: 1(0,0)
Pad_ie69
  round 1 hole 0.6: 2(0,0)
Pad_ie70
  round 1 hole 0.6: 3(0,0)
Pad_ie71
  round 1 hole 0.6: 4(0,0)
Pad_ie72
  round 1 hole 0.6: 5(0,0)
Pad_ie73
  round 1 hole 0.6: 6(0,0)
Pad_ie74
  round 1 hole 0.6: 4(0,0)
Pad_ie75
  round 1 hole 0.6: 3(0,0)
Pad_ie76
  round 1 hole 0.6: 2(0,0)
Pad_ie77
  round 1 hole 0.6: 1(0,0)
Pad_ie78
  round 1 hole 0.6: 1(0,0)
Pad_ie79
  round 1 hole 0.6: 2(0,0)
Pad_ie80
  round 1 hole 0.6: 3(0,0)
Pad_ie81
  round 1 hole 0.6: 4(0,0)
Pad_ie82
  round 1 hole 0.6: 6(0,0)
Pad_ie83
  round 1 hole 0.6: 5(0,0)
Pad_ie84
  round 1 hole 0.6: 4(0,0)
Pad_ie85
  round 1 hole 0.6: 3(0,0)
Pad_ie86
  round 1 hole 0.6: 2(0,0)
Pad_ie87
  round 1 hole 0.6: 1(0,0)
Pad_ie88
  round 1 hole 0.6: 0(0,0)
Pad_ie89
  round 0.8 hole 0.5: 0(0,0)
Pad_ie90
  round 0.8 hole 0.5: 3(0,0)
Pad_ie91
  round 0.8 hole 0.5: 4(0,0)
Pad_ie92
  round 0.8 hole 0.5: 5(0,0)
Pad_ie93
  round 0.8 hole 0.5: 6(0,0)
Pad_ie94
  round 0.8 hole 0.5: 7(0,0)
Pad_ie95
  round 0.8 hole 0.5: 8(0,0)
Pad_ie96
  round 0.8 hole 0.5: 9(0,0)
Pad_ie97
  round 0.8 hole 0.5: 10(0,0)
Pad_ie98
  round 0.8 hole 0.5: 1(0,0)
Pad_ie99
  round 0.8 hole 0.5: 1(0,0)
Pad_ie100
  round 0.8 hole 0.5: 2(0,0)
Pad_ie101
  round 1 hole 0.6: 8(0,0)
Pad_ie102
  round 1 hole 0.6: 8(0,0)
SIP4
  rect 1.2x1.2 hole 0.8: 1(0,0)
  round 1.2 hole 0.8: 2(2.54,0) 3(5.08,0) 4(7.62,0)
SMA
  rect 2x2 smd: 1(2.1,0) 2(-2.1,0)
SMB
  rect 2.29x2.72 smd: 1(2.025,0) 2(-2.025,0)
SMC
  rect 3.03x3.82 smd: 1(3.435,0) 2(-3.435,0)
SMD8
  rect 1.6x2.6 smd: 1(-3.81,-4.8) 2(-1.27,-4.8) 3(1.27,-4.8) 4(3.683,-4.8) 5(3.81,4.8) 6(1.27,4.8) 7(-1.27,4.8) 8(-3.81,4.8)
SMD8#2
  rect 1.6x2.6 smd: 1(-3.81,-4.8) 2(-1.27,-4.8) 3(1.27,-4.8) 4(3.683,-4.8) 5(3.81,4.8) 7(-1.27,4.8) 8(-3.81,4.8)
  rect 1.5x2.6 smd: 6(1.27,4.8)
SOD-123
  rect 1.5x1.1 smd: 1(-1.5,0) 2(1.5,0)
SOP4
  rect 2.083x0.813 smd: 1(-2.946,1.282)
  oval 2.083x0.762 smd: 2(-2.946,-1.282) 3(2.946,-1.282) 4(2.946,1.282)
SOT-23-5
  rect 1.1x0.6 smd: 1(-1.4,0.95) 2(-1.4,0) 3(-1.4,-0.95) 4(1.4,-0.95) 5(1.4,0.95)
SOT-223
  rect 1.1x1.6 smd: 1(-2.3,-2.7) 2(0,-2.7) 3(2.3,-2.7)
  rect 3.6x2 smd: 4(0,2.8)
TO-252
  rect 1.2x2 smd: 1(-2.3,-2.6) 3(2.3,-2.6)
  rect 5.8x5.8 smd: 2(0,4.1)
TO-263
  rect 1.05x2.7 smd: 1(-3.4,-4.526) 2(-1.7,-4.526) 3_1(0,-4.526) 4(1.7,-4.526) 5(3.4,-4.526)
  rect 10x10.3 smd: 3(0,4.526)
TO-263-2
  rect 3x1.5 smd: 1(0,-2.54) 3(0,2.54)
  rect 10x10.1 smd: 2(-10,0)
USB-TYPE-C-16P-全贴片
  round 0.65 hole 0.65: (2.89,1.212) _1(-2.89,1.212)
  rect 1.8x1.5 smd: 1(-5.33,1.712) 2(5.33,1.712) 3(-5.33,-2.288) 4(5.33,-2.288)
  rect 0.26x1.9 smd: A1(-3.35,2.693) A4(-2.55,2.693) A5(-1.25,2.693) A6(-0.25,2.693) A7(0.25,2.693) A8(1.25,2.693) A9(2.55,2.692) A12(3.35,2.693) B1(3.15,2.693) B4(2.35,2.692) B5(1.75,2.693) B6(0.75,2.693) B7(-0.75,2.693) B8(-1.75,2.693) B9(-2.35,2.693) B12(-3.15,2.693)
VH3.96-2P直插座
  rect 2.54x2.54 hole 1.524: 1(2.151,0.84)
  round 2.54 hole 1.524: 2(-1.863,0.84)
按键6x6贴片
  rect 0.8x1.5 smd: 1(2.2,4) 2(-2.2,4) 3(2.2,-4) 4(-2.2,-4)
晶振贴片
  rect 3x1.5 smd: 1(-5,0) 2(5,0)
电感贴片12x12
  rect 2x5 smd: 1(-5,0) 2(5,0)
电解电容贴片6x6
  rect 3x1 smd: 1(-2.8,0) 2(2.8,0)
直插座4P-DF2EDGK
  rect 2.4x2.4 hole 1.4: 1(-7.5,0)
  round 2.4 hole 1.4: 2(-2.5,0) 3(2.5,0) 4(7.5,0)

## Nets
3V3-S: C4.1 C5.2 C6.2 C7.2 C21.1 C22.2 P4.2 R3.1 R7.2 R8.1 R14.1 R20.1 R22.1 R24.1 R26.1 R27.1 R29.1 R31.1 R33.1 R35.1 R37.1 R39.1 R41.1 R43.1 R45.1 R70.2 R71.2 R72.2 R73.2 U1.9 U1.24 U1.36 U1.48 U5.2 U5.4
12V: C14.2 C17.1 C18.2 C19.2 L1.2 NOREF#49.8 NOREF#51.8 NOREF#57.0 P11.2 P13.1 R10.2 U2.1
24V: C33.1 C34.1 C35.1 C36.1 C38.1 C86.1 D3.1 D8.2 J1.8 J3.8 J5.8 J7.8 J13.8 NOREF#7.1 NOREF#42.8 P6.1 P8.1 P10.2 P30.1 R81.1
48V: D9.2 P7.1 P7.3 R13.1
GND: C10.2 C12.2 C13.1 C15.2 C16.1 C17.2 C18.1 C19.1 C23.1 C24.1 C25.1 C26.1 C27.1 C28.1 C29.1 C30.1 C31.2 C32.1 C33.2 C34.2 C35.2 C36.2 C37.1 C38.2 C85.1 C86.2 D4.1 D21.2 DZ1.1 DZ2.1 DZ3.1 J1.1 J1.7 J3.1 J3.7 J5.1 J5.7 J7.1 J7.7 J13.1 J13.7 NOREF#19.0 NOREF#34.1 P6.2 P6.3 P6.4 P6.5 P7.2 P9.2 P9.4 P9.6 P9.8 P9.10 P9.12 P9.14 P9.16 P9.18 P9.20 P10.1 P11.1 P12.1 P13.2 P15.1 P19.1 P21.1 P22.1 P30.2 Q1.3 Q2.3 R11.1 R47.2 R48.2 R49.2 R50.2 R51.2 R52.2 R53.2 R54.2 R55.2 R56.2 R57.2 R58.2 R60.2 R61.2 R62.2 R74.2 R75.1 U2.2 U3.1 U4.2 U6.3 U12.3 U13.5 U14.5 U15.5 U16.5 U17.3 U18.3 U19.3 U20.3 U21.5 U22.3
GND-S: C1.1 C2.2 C3.2 C4.2 C5.1 C6.1 C7.1 C8.1 C9.1 C20.2 C21.2 C22.1 C70.1 C71.1 C72.1 C73.1 D10.2 K1.1 K1.3 P1.2 P2.3 P2.4 P3.2 P3.4 P3.6 P3.8 P4.1 P5.1 P5.2 P5.3 P5.4 P5.A1 P5.A12 P5.B1 P5.B12 R1.1 R2.1 R6.1 R59.2 R80.2 U1.8 U1.23 U1.35 U1.47 U4.4 U5.1 U8.3 U9.3 U10.3 U11.3
VCC: C12.1 C15.1 C16.2 C27.2 C28.2 C29.2 C30.2 C31.1 C32.2 J1.2 J3.2 J5.2 J7.2 J9.4 J9.5 J9.6 J10.4 J10.5 J10.6 J11.4 J11.5 J11.6 J12.4 J12.5 J12.6 J13.2 J15.4 J15.5 J15.6 NOREF#5.0 P9.17 P9.19 P15.4 P15.6 P19.4 P19.6 P21.4 P21.6 P22.4 P22.6 R19.1 R21.1 R23.1 R25.1 R28.1 R30.1 R32.1 R34.1 R36.1 R38.1 R40.1 R42.1 R44.1 R46.1 R85.1 U2.3 U4.1 U6.5 U13.7 U13.8 U14.7 U14.8 U15.7 U15.8 U16.7 U16.8 U21.7 U21.8 U22.5
VCC-S: C9.2 C20.1 D2.2 NOREF#30.12 P1.1 P2.1 P2.2 U4.6 U5.3
A_LIMT: C26.2 P9.1 P9.3 U11.2
A_LIMT-S: R26.2 U1.28 U11.4
BOOT0: R1.2 U1.44
BOOT1: R2.2 U1.20
HOLD-S: C73.2 P3.7 R73.1 U1.39
LASER_PWM: R15.2 R16.1 U6.4
MA_1A: J7.4 P20.3
MA_1B: J7.3 P20.4
MA_2A: J7.5 P20.2
MA_2B: J7.6 P20.1
MA_DIR: J8.1 P21.3 R44.2 U20.4
MA_DIR-S: U1.11 U20.2
MA_DIV1: J8.5 J12.3 R58.1
MA_DIV2: J8.6 J12.2 R54.1
MA_DIV3: J8.7 J12.1 R50.1
MA_STEP: J8.2 P21.5 R36.2 U16.6
MA_STEP-S: U1.10 U16.3
MOTOR_EN: J2.8 J4.8 J6.8 J8.8 J14.8 P15.2 P19.2 P21.2 P22.2 U22.4
MOTOR_EN-S: U1.18 U12.2
MX_1A: J1.4 P14.3
MX_1B: J1.3 P14.4
MX_2A: J1.5 P14.2
MX_2B: J1.6 P14.1
MX_DIR: J2.1 P15.3 R38.2 U17.4
MX_DIR-S: U1.17 U17.2
MX_DIV1: J2.5 J9.3 R55.1
MX_DIV2: J2.6 J9.2 R51.1
MX_DIV3: J2.7 J9.1 R47.1
MX_STEP: J2.2 P15.5 R30.2 U13.6
MX_STEP-S: U1.16 U13.3
MY2_1A: J13.4 NOREF#21.1 P16.2
MY2_1B: J13.3 P16.1
MY2_2A: J13.5 NOREF#9.1 P16.3
MY2_2B: J13.6 P16.4
MY2_DIV1: J14.5 J15.3 R62.1
MY2_DIV2: J14.6 J15.2 R61.1
MY2_DIV3: J14.7 J15.1 R60.1
MY_1A: J3.4 P17.3
MY_1B: J3.3 P17.4
MY_2A: J3.5 P17.2
MY_2B: J3.6 P17.1
MY_DIR: J4.1 J14.1 P22.3 R40.2 U18.4
MY_DIR-S: U1.15 U18.2
MY_DIV1: J4.5 J10.3 R56.1
MY_DIV2: J4.6 J10.2 R52.1
MY_DIV3: J4.7 J10.1 R48.1
MY_STEP: J4.2 J14.2 P22.5 R32.2 U14.6
MY_STEP-S: U1.14 U14.3
MZ_1A: J5.4 P18.3
MZ_1B: J5.3 P18.4
MZ_2A: J5.5 P18.2
MZ_2B: J5.6 P18.1
MZ_DIR: J6.1 P19.3 R42.2 U19.4
MZ_DIR-S: U1.13 U19.2
MZ_DIV1: J6.5 J11.3 R57.1
MZ_DIV2: J6.6 J11.2 R53.1
MZ_DIV3: J6.7 J11.1 R49.1
MZ_STEP: J6.2 P19.5 R34.2 U15.6
MZ_STEP-S: U1.12 U15.3
NETC10_1: C10.1 C11.2 C13.2 C37.2 D3.2 DZ1.2 U3.5
NETC11_1: C11.1 U3.4
NETC14_1: C14.1 R10.1 R11.2 U3.2
NETC85_2: C85.2 R85.2 U6.1
NETD1_1: D1.1 R7.1
NETD1_2: D1.2 U1.38
NETD2_1: D2.1 P24.2
NETD4_2: D4.2 L1.1 NOREF.2 NOREF#3.4 NOREF#4.2 NOREF#6.6 NOREF#8.3 NOREF#10.2 NOREF#11.1 NOREF#12.2 NOREF#13.4 NOREF#14.2 NOREF#15.1 NOREF#16.3 NOREF#17.1 NOREF#18.4 NOREF#20.4 NOREF#22.2 NOREF#23.3 NOREF#24.5 NOREF#25.3 NOREF#26.3 NOREF#28.2 NOREF#29.2 NOREF#31.3 NOREF#32.3 NOREF#35.3 NOREF#37.0 NOREF#38.1 NOREF#39.3 NOREF#40.1 NOREF#41.0 NOREF#43.2 NOREF#44.6 NOREF#45.4 NOREF#46.0 NOREF#47.0 NOREF#48.1 NOREF#52.1 NOREF#53.6 NOREF#54.4 NOREF#59.4 NOREF#60.3 NOREF#61.1 NOREF#62.4 NOREF#63.1 NOREF#64.3 NOREF#65.6 NOREF#67.4 NOREF#68.6 NOREF#69.4 NOREF#70.2 NOREF#71.3 NOREF#72.1 NOREF#73.6 NOREF#74.5 NOREF#75.4 NOREF#76.4 NOREF#77.2 NOREF#78.2 U3.3 U3.3_1
NETD7_1: D7.1 R13.2
NETD7_2: D7.2 D9.1 NOREF#2.8 NOREF#27.4 NOREF#33.10 NOREF#36.3 NOREF#50.6 NOREF#55.9 NOREF#56.7 NOREF#58.5 NOREF#66.2 P7.4 Q2.2
NETD8_1: D8.1 P8.2 Q1.2
NETD10_1: D10.1 R14.2
NETD20_1: D20.1 P23.1 R9.1
NETD20_2: D20.2 R80.1
NETD21_1: D21.1 R81.2
NETDZ2_2: DZ2.2 DZ3.2 Q1.1 Q2.1 R16.2 R74.1 R75.2
NETJ2_3: J2.3 J2.4
NETJ4_3: J4.3 J4.4
NETJ6_3: J6.3 J6.4
NETJ8_3: J8.3 J8.4
NETJ14_3: J14.3 J14.4
NETP2_6: P2.6 R4.2
NETP2_8: P2.8 R5.2
NETP12_2: P12.2 P13.3 P30.3 R15.1
NETR19_2: R19.2 U8.1
NETR21_2: R21.2 U9.1
NETR23_2: R23.2 U10.1
NETR25_2: R25.2 U11.1
NETR27_2: R27.2 U12.1
NETR28_2: R28.2 U12.4 U22.2
NETR29_2: R29.2 U13.2
NETR31_2: R31.2 U14.2
NETR33_2: R33.2 U15.2
NETR35_2: R35.2 U16.2
NETR37_2: R37.2 U17.1
NETR39_2: R39.2 U18.1
NETR41_2: R41.2 U19.1
NETR43_2: R43.2 U20.1
NETR45_2: R45.2 U21.2
NETR46_2: R46.2 U6.2 U21.6
NRST: C1.2 R3.2 U1.7
PROBE-S: C71.2 P3.3 R71.1 U1.41
RESET-S: C70.2 K1.2 K1.4 P2.5 P3.1 R70.1 U1.42
RUN-S: C72.2 P3.5 R72.1 U1.40
RXD-S: P1.3 R5.1 U1.31
SPINDLE_PWM-S: R6.2 U1.29 U21.3
SWCLK: P4.3 U1.37
SWDIO: P4.4 U1.34
TXD-S: P1.4 R4.1 U1.30
USB-CHK: R9.2 R59.1 U1.19
USB_DM: P5.A7 P5.B7 U1.32
USB_DP: P5.A6 P5.B6 R8.2 U1.33
VUSB: C8.2 P5.A4 P5.A9 P5.B4 P5.B9 P23.2 P24.1
X_LIMT: C23.2 P9.13 P9.15 U8.2
X_LIMT-S: R20.2 U1.25 U8.4
XTAL1: C3.1 U1.5 Y1.1
XTAL2: C2.1 U1.6 Y1.2
Y_LIMT: C24.2 P9.9 P9.11 U9.2
Y_LIMT-S: R22.2 U1.26 U9.4
Z_LIMT: C25.2 P9.5 P9.7 U10.2
Z_LIMT-S: R24.2 U1.27 U10.4

Pads without a net: P2 7; P5 _1 A5 A8 B5 B8; P6 6; U1 1 2 3 4 21 22 43 45 46; U13 1 4; U14 1 4; U15 1 4; U16 1 4; U21 1 4; U22 1

## Via types
v1: diameter 0.5, hole 0.3, Top Layer to Bottom Layer, 327 vias

## Routing (per net, layer and track width the routed paths; a pad name or vN(x,y) marks a point on that pad's centre or on a via; arc(x,y) is an arc through that point)
3V3-S: length 247.8
  Top Layer w0.254: R7.2 62.4,10.3
  Top Layer w0.3: v1(47.5,35.65) R37.1 ; 111.3,33.3 R45.1 ; R24.1 51.3,15.7 51.3,18.9 ; 71.28,27.6 U1.24 75.75,26.15 77.35,24.55 ; v1(111.2,34.1) 111.2,33.4 109.8,32 v1(107.1,32) 89.6,32 88.9,31.3 88.9,30.5 89.2,30.2 92.5,30.2 92.94,29.76 R3.1 ; v1(82.2,35.65) 82.36,35.48 82.36,27.25 80.5,25.39 80.5,24.55 ; R27.1 107.5,35.65 v1(106.6,35.65) 105.6,35.65 ; 77.35,24.55 77.35,21.25 76.65,20.55 U1.36 74.2,19.2 73.83,18.83 C6.2 69.3,17.43 P4.2 69.3,14.6 69.2,14.5 ; 77.35,24.55 80.5,24.55 ; 80.5,24.55 U1.9 ; 69.2,14.5 R72.2 R73.2 59.7,14.5 59.2,15 ; 69.2,14.5 R70.2 ; R43.1 v1(91.7,35.65) R33.1 ; v1(107.1,30.1) 107.1,21.6 111.1,17.6 R8.1 ; 43.4,18.9 43.4,15.8 R22.1 ; 78.5,35.65 76.5,35.65 ; R20.1 36,16 35.3,16.7 33.3,16.7 32.7,17.3 32.7,20 ; R29.1 v1(62.7,35.65) R39.1 ; C7.2 81.25,15.22 U1.48 81.25,20.45 79.85,21.85 77.35,21.85 ; 70.88,27.8 70.93,27.75
  Top Layer w1: 38.4,18.9 37.3,20 U5.2 U5.4 ; R7.2 60.5,10.3 59.2,11.6 59.2,17.7 57.1,19.8 C4.1 54,19.8 53.41,19.22 38.21,19.22 ; C22.2 38.34,19.22
  Bottom Layer w0.3: v1(47.5,35.65) v1(62.7,35.65) 109.65,35.65 v1(111.2,34.1) ; v1(107.1,30.1) v1(107.1,32)
  vias: v1(77.2,35.65)
12V: length 186.5
  Top Layer w0.6: R10.2 7.4,23.8 NOREF#57.0
  Top Layer w1: U2.1 26.9,39.3 22.7,43.5 C17.1
  Top Layer w1.6: P11.2 115.07,61.13 115.07,75.03 109.3,80.8 P13.1
  Top Layer w2: 22.2,45.3 NOREF#49.8 NOREF#51.8 16.5,45.3 16.1,45.7 16.1,49.7
  Bottom Layer w0.6: NOREF#51.8 15,40.3 15,28.2 NOREF#57.0
  Bottom Layer w2: P11.2 114.33,58.9 113.4,57.97 113.4,47.6 111.3,45.5 20.2,45.5
24V: length 338
  Top Layer w0.3: 18.7,15.2 19.7,14.2 19.7,13.3
  Top Layer w1: J3.8 50.2,60.02 50.2,66.2 52.6,68.6 53.7,68.6 ; J7.8 99.4,60.02 99.4,66.4 101.6,68.6 102.9,68.6 ; 86.4,68.6 85.3,68.6 83,66.3 83,60.02 J5.8 ; 70.1,68.6 69,68.6 66.6,66.2 66.6,60.02 J13.8 ; J1.8 32.72,58.22 33.7,59.2 33.7,66.1 36.2,68.6 37.2,68.6
  Top Layer w1.2: 70.1,68.6 72.3,70.8 72.3,79.7 ; 39.5,80.1 39.5,70.4 37.7,68.6 ; 88.4,80.1 88.4,70.6 86.4,68.6 ; 53.7,68.6 55.8,70.7 55.8,79.7 ; 102.9,68.6 104.9,70.6 NOREF#7.1
  Top Layer w1.6: D8.2 23.8,57.7 NOREF#42.8 ; NOREF#7.1 102.2,80.1 39.5,80.1 39.5,84.6 38.2,85.9 32.98,85.9 32.4,85.32 32.4,83.2 ; 37.2,68.6 37.7,68.6
  Top Layer w2: 23.7,13.3 19.7,13.3 18.4,12 P6.1 16.6,11.9 16.6,14.9 ; 23.7,13.3 23.8,13.2 23.8,3.4 P30.1 ; 23.7,13.3 24.6,13.3 25.3,14
  Bottom Layer w1.6: NOREF#7.1 105.8,78.3 111.8,78.3 115.43,74.67 P10.2
  Bottom Layer w2: P6.1 14.6,12 4.6,22 4.6,25.1 8.3,28.8 8.3,41.8 29.3,62.8 29.3,77.8 32.6,81.1 P8.1
48V: length 65.9
  Top Layer w0.3: 24.4,69.5 25.4,69.5 25.8,69.9 25.8,78.1 29.8,82.1 29.8,83.8 28.6,85 22.7,85
  Top Layer w1.6: 6.47,61.2 3.8,63.86 3.8,73.72 12.7,82.62 ; 12.7,82.62 12.9,82.82 ; 12.7,82.62 12.7,84.3 13.9,85.5 22.2,85.5 22.9,84.8 22.9,82.82
GND: length 111.7
  Top Layer w0.3: 103.03,47.5 103.03,49.69 ; 103.03,47.5 103.58,48.05 U22.3 ; 103.03,47.5 103.03,47.18 U16.5 ; 74.31,47.1 74.57,47.36 ; C29.1 89.47,48.06 U15.5 ; U18.3 64.18,46.22 v1(63.4,47) ; U17.3 49.58,46.42 49,47 v1(48.5,47) ; U14.5 74.57,47.76 C28.1 ; 108.06,46.06 v1(109,47) ; U19.3 77.94,47 v1(77.9,47) ; C85.1 114.88,51.15 U6.3 v1(117.15,51.15) ; R74.2 44,34.78 DZ2.1 ; 59.41,47.89 59.41,47.1 59.75,47.44 59.75,49.69
  Top Layer w0.6: DZ3.1 17.3,61.5 R75.1 17.2,59.5 16.6,58.9 11.2,58.9 10.6,59.5 10.6,65.46 Q2.3
  Top Layer w1.6: 17.9,82.82 17.22,82.82 11.1,76.7 11.1,71.16 8.07,68.13
  Bottom Layer w1.4: 1.2,27.9 1.2,61.26 10.5,70.56
  vias: v1(1,24.14) v1(1,23.34) v1(1,22.54) v1(1,21.74) v1(1,20.94) v1(1,20.14) v1(1,19.32) v1(1,18.52) v1(1,17.72) v1(1,16.92) v1(1,16.12) v1(1,15.32) v1(1,14.5) v1(1,13.7) v1(1,12.9) v1(1,12.1) v1(1,11.22) v1(1,10.42) v1(1,9.62) v1(1,8.82) v1(1.8,24.14) v1(1.8,23.34) v1(1.8,22.54) v1(1.8,21.74) v1(1.8,20.94) v1(1.8,20.14) v1(1.8,19.32) v1(1.8,18.52) v1(1.8,17.72) v1(1.8,16.92) v1(1.8,16.12) v1(1.8,15.32) v1(1.8,14.5) v1(1.8,13.7) v1(1.8,12.9) v1(1.8,12.1) v1(1.8,11.22) v1(1.8,10.42) v1(1.8,9.62) v1(1.8,8.82) v1(13.9,18.3) v1(14.4,20.39) v1(16.4,34.4) v1(16.4,33.6) v1(16.4,32.8) v1(16.4,32) v1(16.4,31.2) v1(18.8,23.5) v1(19.69,47.6) v1(20.49,47.6) v1(20.7,38.3) v1(20.7,37.5) v1(21.29,47.6) v1(21.5,38.3) v1(21.5,37.5) v1(23.77,25.42) v1(23.77,24.6) v1(23.77,23.8) v1(23.77,23) v1(23.77,22.2) v1(23.77,21.4) v1(24.6,55.3) v1(24.6,54.5) v1(24.6,53.7) v1(24.6,52.9) v1(24.6,52.1) v1(24.6,51.3) v1(24.6,50.5) v1(24.6,49.7) v1(24.57,25.42) v1(24.57,24.6) v1(24.57,23.8) v1(24.57,23) v1(24.57,22.2) v1(24.57,21.4) v1(25.3,25.42) v1(25.3,24.6) v1(25.3,23.8) v1(25.3,23) v1(25.3,22.2) v1(25.3,21.4) v1(25.4,55.3) v1(25.4,54.5) v1(25.4,53.7) v1(25.4,52.9) v1(25.4,52.1) v1(25.4,51.3) v1(25.4,50.5) v1(25.4,49.7) v1(26.1,25.42) v1(26.1,24.6) v1(26.1,23.8) v1(26.1,23) v1(26.1,22.2) v1(26.1,21.4) v1(26.8,8.5) v1(26.8,7.7) v1(27.6,8.5) v1(27.6,7.7) v1(34.2,7.6) v1(34.91,58.1) v1(35.71,58.1) v1(38.1,75.4) v1(38.1,74.6) v1(38.1,73.8) v1(41.6,42.2) v1(41.6,41.4) v1(41.6,40.6) v1(41.6,39.8) v1(41.6,39) v1(42.4,42.2) v1(42.4,41.4) v1(42.4,40.6) v1(42.4,39.8) v1(42.4,39) v1(42.94,7.6) v1(43.2,42.2) v1(43.2,41.4) v1(44,42.2) v1(44,41.4) v1(48.4,78.03) v1(48.36,77.2) v1(50.6,7.6) v1(51.6,58.3) v1(52.3,58.3) v1(54.5,75.4) v1(54.5,74.6) v1(54.5,73.8) v1(57.6,5.73) v1(57.8,7.73) v1(67.6,58.3) v1(68.4,58.3) v1(70.9,77.7) v1(70.9,76.9) v1(70.9,76.1) v1(70.9,75.3) v1(70.9,74.5) v1(70.9,73.7) v1(81.21,78) v1(81.2,77.13) v1(83.6,58.7) v1(84.4,58.37) v1(87.3,77.8) v1(87.3,77) v1(87.3,76.2) v1(87.3,75.4) v1(87.3,74.6) v1(87.3,73.8) v1(90.8,48.8) v1(91.5,48.8) v1(93.2,47) v1(99.9,58.7) v1(100.6,58.53) v1(103.7,75.4) v1(103.7,74.6) v1(103.7,73.8) v1(104.6,48.05) v1(118.3,45.1) v1(118.3,44.3) v1(119.1,45.1) v1(119.1,44.3)
GND-S: length 39.2
  Top Layer w0.254: v1(69,19.9) 69.47,20.37 ; C2.2 85.8,25.4 84.45,24.05 U1.8
  Top Layer w0.3: C5.1 69.33,28.59 ; 69.33,28.59 69.34,28.6 71.9,28.6 72.9,29.6 75.4,29.6 76.25,28.75 U1.23 ; 69.33,28.59 69.33,29.78 R2.1 ; 80.7,13 81.88,13 C7.1 ; 80.7,13 80.75,13.05 U1.47 ; 80.7,13 R1.1 ; v1(31.56,15.4) 32.7,15.4 ; K1.3 81.01,1.3 ; v1(39.45,15.35) U9.3 ; v1(101,12.5) C9.1 ; v1(34.06,17.7) 35.2,17.7 ; R59.2 109.1,13.2 v1(108.7,12.8) ; U1.35 74.18,21.03 71.35,21.03 C6.1 69.47,20.37 ; v1(47.35,15.45) U10.3 ; v1(55.15,15.45) U11.3
  vias: v1(31.2,31.5) v1(31.2,30.7) v1(31.2,29.9) v1(31.2,29.1) v1(31.2,28.3) v1(32,31.5) v1(32,30.7) v1(32,29.9) v1(32,29.1) v1(32,28.3) v1(42.93,26.62) v1(42.93,25.82) v1(43.73,26.62) v1(43.73,25.82) v1(44.43,17.9) v1(44.53,26.62) v1(44.53,25.82) v1(45.33,26.62) v1(45.33,25.82) v1(47.79,17.9) v1(54.8,18.21) v1(55.4,17.57) v1(60.4,22.1) v1(60.4,21.3) v1(61.2,22.1) v1(61.2,21.3) v1(62,22.1) v1(62,21.3) v1(62.8,22.1) v1(62.8,21.3) v1(86.9,27) v1(87.7,27) v1(89.1,14.4) v1(89.1,13.6) v1(89.9,14.4) v1(89.9,13.6) v1(90.7,14.4) v1(90.7,13.6) v1(92.35,20.4) v1(92.35,19.6) v1(93.15,20.4) v1(93.15,19.6) v1(102.4,27.3) v1(102.4,26.5) v1(103.2,27.3) v1(103.2,26.5) v1(106.6,18.7) v1(106.6,17.9) v1(111.2,5.3) v1(111.2,4.5) v1(112,5.3) v1(112,4.5) v1(119,33.4) v1(119,32.6)
VCC: length 497.4
  Top Layer w0.3: R21.1 36.2,11.3 36,11.5 ; 36,11.5 29.31,11.5 28.7,12.12 28.7,17.1 28.4,17.4 R19.1 24.2,17.4 C31.1 ; 36,11.5 50.74,11.5 R25.1 ; 88.66,65.8 88.66,65.86 ; 88.66,65.8 J11.4 ; 88.66,65.8 88.66,68.66 90,70 v1(90,71.8) ; R34.1 84.3,49.7 ; R34.1 84.03,49.42 84.03,47.1 ; R34.1 84.29,49.7 ; v1(70.6,71.6) 66.66,71.6 J13.2 ; 84.29,49.7 84.29,50.38 P19.4 88.66,54.74 v1(88.66,56.04) ; 84.29,49.7 R42.1 ; 69.23,47.1 69.23,48 ; 69.23,47.1 69.4,47.27 R32.1 ; 69.23,47.1 69.23,44.6 ; 69.23,48 66.69,48 ; 69.23,48 69.4,48.17 ; 113.1,49.7 R46.1 113.8,47.37 U21.7 ; 113.1,49.7 R28.1 ; 113.1,49.7 113,49.8 R85.1 112.3,51.4 111.8,51.9 111.8,53.9 112.2,54.3 117.8,54.3 119,53.1 U6.5 ; v1(37.6,71.4) 34.06,71.4 J1.2 ; R32.1 69.4,52.78 P22.4 ; R32.1 69.4,50.4 ; R32.1 69.4,49.7 R40.1 ; v1(57.2,72) 57.2,69.9 56.6,69.3 ; 73,69.3 73.6,69.9 v1(73.6,72) ; 73,69.3 72.26,68.56 J15.4 ; 73,69.3 73.3,69.6 ; 84.03,47.1 84.03,48 81.49,48 ; 84.03,47.1 84.03,46.3 ; 56.6,69.3 56.9,69.6 ; 56.6,69.3 55.86,68.56 J10.4 ; U4.1 18.91,35.59 18.91,37.01 18.3,37.62 18.3,37.85 ; v1(41,72.2) 41,69.2 39.36,67.56 J9.4 ; U16.8 U16.7 ; U16.7 98.03,44.6 ; U16.7 98.03,49.07 R44.1 99.4,49.7 R36.1 99.4,50.5 99.8,50.9 100.9,50.9 101.6,51.6 103.32,51.6 P21.4 104.72,55.8 v1(105.06,56.14) ; 45.16,44.6 54.7,44.6 ; 45.16,44.6 45.16,49.64 44.5,50.3 42.8,50.3 41.7,51.4 41.7,55.7 v1(40.3,57.1) ; 45.16,44.6 45.16,43.94 v1(45.2,43.9) ; 54.7,44.6 69.23,44.6 ; 54.7,44.6 54.33,44.97 54.33,46.8 ; v1(55.86,56.84) 55.86,53.52 P15.6 58.2,51.18 C27.2 58.2,49.94 ; 98.03,44.6 84.03,44.6 ; 98.03,44.6 110.4,44.6 110.6,44.8 110.6,47.1 ; C29.2 87.93,50.43 89.2,51.7 90.62,51.7 P19.6 ; 84.03,44.6 84.03,46.3 ; 84.03,44.6 69.23,44.6 ; v1(106.4,71.8) 106.4,70 105.06,68.66 J12.4 105.06,65.86 ; 54.33,46.8 54.03,47.1 51.79,47.1 ; 54.33,46.8 54.33,47.1 54.5,47.27 R30.1 54.5,49.7 R38.1 52.4,51.98 P15.4 ; U21.7 113.33,47.1 ; U21.7 U21.8 110.99,47.31 110.6,47.7 ; 23,16.3 23.05,16.35 ; 84.03,46.3 84.03,46.07 ; C28.2 73.03,51.85 P22.6 73.3,53.88 v1(73.3,55.6) ; R23.1 44.1,11.4 ; U22.5 108.7,49.59 110.6,47.69 ; J5.2 82.86,71.8 v1(87,71.8) ; P21.6 108.42,51.7 107.5,51.7 106.9,51.1 105.5,51.1 104.57,50.17 104.57,49.69 ; J3.2 50.26,71.6 v1(54.2,71.6) ; v1(103.5,71.8) 99.26,71.8 J7.2
  Top Layer w0.6: 20.37,22.73 20.5,22.6 ; 31.6,11.43 31.6,6.7 32.7,5.6 33.41,5.6 34.04,4.97 P9.19 P9.17
  Top Layer w1: U4.1 19.1,33.8 20.5,32.4 20.5,17.8 22,16.3 23,16.3 ; C16.2 18.87,52.33 C15.1 23.6,48.5 24.7,47.4 24.7,43.8 25.9,42.6 NOREF#5.0 33.2,42.6 34.44,41.36 U2.3
  Bottom Layer w0.3: P21.6 109.72,52.02 109.4,51.7 106.02,51.7 P21.4 ; P22.6 74.18,52.08 73.7,51.6 70.1,51.6 69.18,52.52 P22.4 ; P19.4 86.92,52.18 87.4,51.7 91.5,51.7 91.92,52.12 P19.6 ; 72.26,60.5 J15.4 ; 72.26,60.5 72.26,57.74 73.3,56.7 v1(73.3,55.6) ; 72.26,60.5 J15.6 ; v1(88.66,56.04) J11.6 ; J11.6 J11.5 J11.4 ; J11.6 88.66,59.36 ; v1(73.6,72) 71,72 v1(70.6,71.6) ; J9.6 J9.5 J9.4 ; J9.6 39.36,58.6 ; J9.6 39.36,58.04 v1(40.3,57.1) ; J12.4 J12.5 J12.6 ; v1(105.06,56.14) J12.6 ; J12.6 105.32,59.36 ; P15.6 56.38,52.28 55.7,51.6 52.78,51.6 P15.4 51.38,53.12 ; 55.86,56.44 J10.6 J10.5 J10.4 ; v1(57.2,72) 54.6,72 v1(54.2,71.6) ; v1(41,72.2) 38.4,72.2 v1(37.6,71.4) ; v1(45.2,43.9) 31.6,43.9 NOREF#5.0 ; v1(87,71.8) v1(90,71.8) ; v1(103.5,71.8) v1(106.4,71.8)
  Bottom Layer w1: 19.1,36.6 19.1,38.4 23.3,42.6 NOREF#5.0 30.5,42.6 ; 19.1,36.6 19.1,37.1 ; 19.1,36.6 U4.1
VCC-S: length 109.1
  Top Layer w0.3: C9.2 102.27,15.47 D2.2 104.78,17.98 P1.1
  Top Layer w1: U5.3 34.9,23.1 34.9,32.3 U4.6
  Bottom Layer w0.6: NOREF#30.12 51.7,23.5 57,18.2 85.99,18.2 ; 85.99,18.2 P2.2 P2.1 ; 85.99,18.2 95.1,18.2 96.2,17.1 103.98,17.1 104.78,17.9 P1.1
(no net):
  vias: v1(3.25,83.5) v1(3.25,3.5) v1(5.5,81.5) v1(5.5,5.5) v1(5.5,5.5) v1(5.5,5.5) v1(5.5,5.5) v1(5.5,5.5) v1(5.5,5.5) v1(5.5,5.5) v1(5.5,5.5) v1(5.5,5.5) v1(5.5,5.5) v1(5.5,5.5) v1(5.5,5.5) v1(5.5,5.5) v1(116.5,81.5) v1(116.5,5.5) v1(118.75,83.5) v1(118.75,3.5)
A_LIMT: length 9.8
  Top Layer w0.3: P9.3 P9.1 56.28,4.46 U11.2 ; 56.53,10.3 C26.2
A_LIMT-S: length 36.9
  Top Layer w0.3: v1(52.6,20.4) 52.6,23.4 53.77,24.57 74.18,24.57 U1.28 ; 57.6,15.4 57.6,14.6 56.9,13.9 53.9,13.9 53.72,14.08 U11.4 53.72,17.08 v1(53.7,17.1)
  Bottom Layer w0.3: v1(52.6,20.4) 52.6,19.1 53.7,18 v1(53.7,17.1)
BOOT0: length 4.5
  Top Layer w0.3: U1.44 79.25,14.85 R1.2
BOOT1: length 9.5
  Top Layer w0.3: U1.20 77.75,29.75 77.2,30.3 71.4,30.3 R2.2 70.95,29.75
HOLD-S: length 26.2
  Top Layer w0.3: U1.39 76.75,17.05 75.2,15.5 ; C73.2 v1(66,11.8) R73.1 ; v1(73.6,13.9) 75.2,15.5 ; 75.2,15.5 74.6,14.9
  Bottom Layer w0.3: P3.7 66,4.5 v1(66,11.8) 68.1,13.9 v1(73.6,13.9)
LASER_PWM: length 93.8
  Top Layer w0.3: 114.7,44.1 114.81,44.1 ; 114.7,44.1 48.9,44.1 ; 114.7,44.1 116.6,44.1 117.3,44.8 117.3,49.6 R15.2 117.2,50.1 118.25,51.15 U6.4 ; 48.9,44.1 46.4,44.1 45.81,43.51 45.81,32.91 45.1,32.2 R16.1 ; 48.9,44.1 48.11,44.1
MA_1A: length 20.1
  Bottom Layer w0.6: P20.3 94.14,84.26 100.4,78 100.4,75.9 ; 100.4,75.9 100.4,71.18 J7.4 ; 100.4,75.9 100.35,75.95
MA_1B: length 17.6
  Bottom Layer w0.6: J7.3 99.3,72.62 99.3,76.93 P20.4
MA_2A: length 22.4
  Bottom Layer w0.6: J7.5 101.5,69.74 101.5,79.1 96.68,83.92 P20.2
MA_2B: length 24.8
  Bottom Layer w0.6: J7.6 102.6,68.3 102.6,81.25 P20.1
MA_DIR: length 50.8
  Top Layer w0.3: 112.1,60.3 112.1,57.7 111.4,57 103.9,57 102.18,55.28 P21.3 100.68,51.5 96.8,51.5 95.8,50.5 R44.2 94,49.7 90.72,46.42 U20.4 ; 112.1,60.3 112.1,58.8 ; 112.1,60.3 112.1,71.3 111.2,72.2 109.7,72.2 109.1,72.8 109.1,74.4 J8.1
MA_DIR-S: length 23.2
  Top Layer w0.3: U20.2 93.28,38.82 94.1,38 94.1,34.6 93.4,33.9 88.5,33.9 84.2,29.6 84.2,25.8 83.95,25.55 U1.11
MA_DIV1: length 9.5
  Top Layer w0.3: 102.7,64.7 103,64.7 104.2,63.5 106.4,63.5 J12.3 109.56,64.7 J8.5
MA_DIV2: length 9.5
  Top Layer w0.3: J8.6 109.56,62.16 J12.2 106.34,60.9 104,60.9 102.7,62.2
MA_DIV3: length 9.6
  Top Layer w0.3: 102.7,59.6 104,58.3 106.28,58.3 J12.1 109.56,59.62 J8.7
MA_STEP: length 38.3
  Top Layer w0.3: 112.8,59.7 112.8,57.4 111.8,56.4 108.5,56.4 107.18,55.08 P21.5 105.85,51.67 105.07,51.67 104.4,51 101.8,51 101,50.2 R36.2 101,47.53 U16.6 ; 112.8,59.7 112.8,58.5 ; 112.8,59.7 112.8,72.88 112.22,73.46 J8.2
MA_STEP-S: length 26.6
  Top Layer w0.254: U16.3 100.57,34.97 99.28,33.68
  Top Layer w0.3: U1.10 84.25,25.05 84.7,25.5 84.7,29.2 88.8,33.3 98.9,33.3 99.28,33.68
MOTOR_EN: length 104.6
  Top Layer w0.3: v1(65.5,56.9) 66.3,57.7 77.38,57.7 J14.8 ; U22.4 108.7,48.55 107.8,49.45 107.8,50.45 108.35,51 109.6,51 111.2,52.6 v1(111.2,55.7) ; v1(48.8,56.7) 49.7,57.6 58,57.6 58.62,58.22 J4.8 61.5,57 64.1,54.4 P22.2 ; v1(82.8,57.5) 93.58,57.5 J6.8 ; 104.3,57.6 110.08,57.6 J8.8 ; 104.3,57.6 v1(99.1,57.6) 99.64,57.06 P21.2 ; 104.3,57.6 103.6,57.6 ; J2.8 45.1,56.9 46.3,55.7 P15.2 ; P19.2 v1(81.84,56.64)
  Bottom Layer w0.3: J14.8 79.42,56.7 82,56.7 v1(82.8,57.5) ; J8.8 111.2,57.72 v1(111.2,55.7) ; J4.8 62.82,56.9 v1(65.5,56.9) ; 100.2,53.04 100.24,53 ; J6.8 95.82,56.7 98.2,56.7 v1(99.1,57.6) ; J2.8 46.62,56.7 v1(48.8,56.7)
MOTOR_EN-S: length 42.5
  Top Layer w0.254: v1(78.3,31.1) 78.5,31.1 78.75,30.85 U1.18 ; U12.2 109,39.45 109,33.4 108.3,32.7 89.3,32.7 v1(87.7,31.1)
  Bottom Layer w0.254: v1(78.3,31.1) v1(87.7,31.1)
MX_1A: length 22.9
  Bottom Layer w0.6: 43.63,84.63 P14.3 43.94,83.34 43.4,82.8 41,82.8 34.5,76.3 34.5,70.88 J1.4
MX_1B: length 18.2
  Bottom Layer w0.6: J1.3 33.5,72.42 33.5,76.73 P14.4 41.4,84.03
MX_2A: length 29.4
  Bottom Layer w0.6: 35.58,71.1 35.58,69.92 35.6,69.9 35.6,69.3 32.14,65.84 J1.5 ; 35.58,71.1 35.58,73.73 ; 35.58,71.1 35.58,75.98 41.5,81.9 44.8,81.9 46.48,83.58 P14.2
MX_2B: length 31.5
  Bottom Layer w0.6: 36.6,71.4 36.6,75.5 42,80.9 46,80.9 49.02,83.92 P14.1 ; 36.6,71.4 36.6,67.9 J1.6 ; 36.6,71.4 36.6,72.21
MX_DIR: length 38.4
  Top Layer w0.3: 45.08,76.02 J2.1 ; J2.1 43.6,74.5 43.6,72.8 44.2,72.2 45.7,72.2 46.4,71.5 46.4,56.6 48.84,54.16 P15.3 50.8,51.04 R38.2 ; J2.1 45.3,76 ; R38.2 47.8,49.7 47.02,48.92 U17.4 ; R38.2 50.8,50.16
MX_DIR-S: length 39.1
  Top Layer w0.3: U17.2 49.58,38.62 50.2,38 50.2,36.1 53.9,32.4 78.2,32.4 79.25,31.35 U1.17
MX_DIV1: length 10.1
  Top Layer w0.3: J9.3 40.7,63.5 38,63.5 36.9,64.6 ; 41.4,64.7 43.96,64.7 J2.5
MX_DIV2: length 10.2
  Top Layer w0.3: J2.6 43.96,62.16 41.4,62.16 ; 36.9,62.1 38.1,60.9 40.64,60.9 J9.2
MX_DIV3: length 10.6
  Top Layer w0.3: J2.7 43.96,59.62 41.4,59.62 ; R47.1 38.5,58.2 41.3,58.2 41.9,58.8 J9.1
MX_STEP: length 34.2
  Top Layer w0.3: R30.2 56.87,48.92 56.87,47.1 ; R30.2 56.1,50.74 P15.5 53.84,53.76 53.2,54.4 49.7,54.4 47,57.1 47,71.9 45.44,73.46 J2.2 ; R30.2 56.1,50.38
MX_STEP-S: length 31.8
  Top Layer w0.3: 56.87,38.4 56.87,34.83 58.7,33 78.4,33 79.75,31.65 U1.16
MY2_1A: length 29.6
  Top Layer w0.6: NOREF#21.1 75.2,82.6 72.7,82.6 71.58,83.72 71.58,84.6 71.6,84.58
  Bottom Layer w0.6: 70.2,81.8 74.4,81.8 NOREF#21.1 ; 70.2,81.8 68.3,81.8 67.6,81.1 67.6,71.18 J13.4 ; 70.2,81.8 71.6,81.8
MY2_1B: length 21.1
  Bottom Layer w0.6: J13.3 66.5,72.62 66.5,81.6 67.8,82.9 73.8,82.9 74.12,83.22 74.12,84.6
MY2_2A: length 35.8
  Top Layer w0.6: 69.1,84.54 69.1,84.1 71.5,81.7 76,81.7 76.9,82.6 NOREF#9.1 ; 69.1,84.54 69.2,84.44 ; 69.1,84.54 69.04,84.6
  Bottom Layer w0.6: NOREF#9.1 76.9,82.6 75.2,80.9 69.4,80.9 68.6,80.1 68.6,69.64 J13.5
MY2_2B: length 23.4
  Bottom Layer w0.6: J13.6 64.7,63.3 63.2,64.8 63.2,81.3 66.5,84.6
MY2_DIV1: length 9.9
  Top Layer w0.3: J14.5 76.76,64.7 74.7,64.7 74.7,64 74.2,63.5 71.1,63.5 R62.1
MY2_DIV2: length 9.9
  Top Layer w0.3: J14.6 76.76,62.16 74.7,62.16 74.7,61.5 74.1,60.9 71.2,60.9 69.9,62.2
MY2_DIV3: length 10
  Top Layer w0.3: J14.7 76.76,59.62 74.7,59.62 74.7,58.9 74.1,58.3 71.2,58.3 R60.1
MY_1A: length 19.6
  Bottom Layer w0.6: J3.4 50.8,70.78 50.8,77 56.44,82.64 56.44,84.6
MY_1B: length 16
  Bottom Layer w0.6: 53.9,84.6 53.9,81.6 49.8,77.5 49.8,72.32 J3.3
MY_2A: length 23.1
  Bottom Layer w0.6: J3.5 51.8,69.24 51.8,76.5 58.98,83.68 58.98,84.6
MY_2B: length 27.1
  Bottom Layer w0.6: 61.12,84.6 61.52,84.6 52.8,75.88 52.8,67.7 J3.6
MY_DIR: length 72.6
  Top Layer w0.3: 65.7,55.3 66.7,56.3 v1(70.6,56.3) ; 65.7,55.3 66.64,54.36 P22.3 65.7,52.06 R40.2 64.8,49.7 61.62,46.52 U18.4 ; 65.7,55.3 64.34,55.3 62.8,56.84 62.8,71.6 62.2,72.2 60.3,72.2 60.1,72.4 60.1,74.6 J4.1 61.48,76.02 ; 77.92,75.98 79.92,73.98 79.92,57.28 79.9,57.27 79.9,56.8 79.4,56.3 v1(72.5,56.3)
  Bottom Layer w0.3: v1(70.6,56.3) v1(72.5,56.3)
MY_DIR-S: length 25.8
  Top Layer w0.3: U1.15 80.25,32.05 78.7,33.6 67.5,33.6 64.9,36.2 64.9,38.3 64.18,39.02 U18.2
MY_DIV1: length 9.5
  Top Layer w0.3: J4.5 60.36,64.7 J10.3 57.1,63.4 54.8,63.4 53.5,64.7
MY_DIV2: length 9.5
  Top Layer w0.3: 53.5,62.2 54.8,60.9 57.14,60.9 J10.2 60.36,62.16 J4.6
MY_DIV3: length 9.7
  Top Layer w0.3: J4.7 60.36,59.62 J10.1 57.08,58.3 54.49,58.3 53.5,59.29 53.5,59.6
MY_STEP: length 62
  Top Layer w0.3: P22.5 71.64,57.05 ; P22.5 71,52.36 R32.2 71.77,48.92 71.77,47.1 ; P22.5 71.4,53 ; J4.2 62.44,73.46 63.4,72.5 63.4,57.3 64.7,56 65.6,56 66.65,57.05 79.05,57.05 79.32,57.32 79.32,72.04 77.92,73.44
MY_STEP-S: length 17.9
  Top Layer w0.3: 71.77,38.4 71.77,35.63 73.27,34.13 79.07,34.13 80.75,32.45 U1.14
MZ_1A: length 18.3
  Bottom Layer w0.6: P18.3 81.54,83.96 83.9,81.6 83.9,71.08 J5.4
MZ_1B: length 16
  Bottom Layer w0.6: P18.4 79,84.4 82.9,80.5 82.9,72.62 J5.3
MZ_2A: length 20.7
  Bottom Layer w0.6: J5.5 85,69.64 85,82.7 84.08,83.62 P18.2
MZ_2B: length 23.6
  Bottom Layer w0.6: P18.1 86.62,83.32 86,82.7 86,68.1 J5.6
MZ_DIR: length 49.2
  Top Layer w0.3: U19.4 76.32,47.72 78.3,49.7 R42.2 80.6,50.9 81.3,51.6 83.1,51.6 84.38,52.88 P19.3 84.38,56.18 85.1,56.9 95.1,56.9 95.7,57.5 95.7,71.7 95.2,72.2 93.2,72.2 92.9,72.5 92.9,74.6 J6.1 94.28,76.02
MZ_DIR-S: length 13.5
  Top Layer w0.3: U19.2 78.88,39.12 79.5,38.5 79.5,34.6 81.25,32.85 U1.13
MZ_DIV1: length 9.5
  Top Layer w0.3: 86.3,64.7 87.5,63.5 90,63.5 J11.3 93.16,64.7 J6.5
MZ_DIV2: length 9.5
  Top Layer w0.3: 86.3,62.2 87.6,60.9 89.94,60.9 J11.2 93.16,62.16 J6.6
MZ_DIV3: length 9.6
  Top Layer w0.3: 86.3,59.6 87.6,58.3 89.88,58.3 J11.1 93.16,59.62 J6.7
MZ_STEP: length 36.1
  Top Layer w0.3: R34.2 85.9,47.77 86.57,47.1 ; R34.2 85.9,50.5 87,51.6 87.98,51.6 P19.5 89.38,55.58 90.1,56.3 95.5,56.3 96.3,57.1 96.3,72.2 95.04,73.46 J6.2 ; R34.2 86.09,49.69
MZ_STEP-S: length 14.1
  Top Layer w0.3: U1.12 83.15,26.05 83.6,26.5 83.6,30 86.57,32.97 86.57,38.4
NETC10_1: length 19.9
  Top Layer w2: 13.8,27.8 16.22,25.38 DZ1.2 16.5,25.17 16.5,19 16.39,18.89 16.39,18.59 12.9,15.1 12.4,15.1 10.3,13 C10.1
